# EAGLE schematic eps_version_0.4.0 (EAGLE 9.6.2)

## Sheet 1 of 9: PC104 Headers
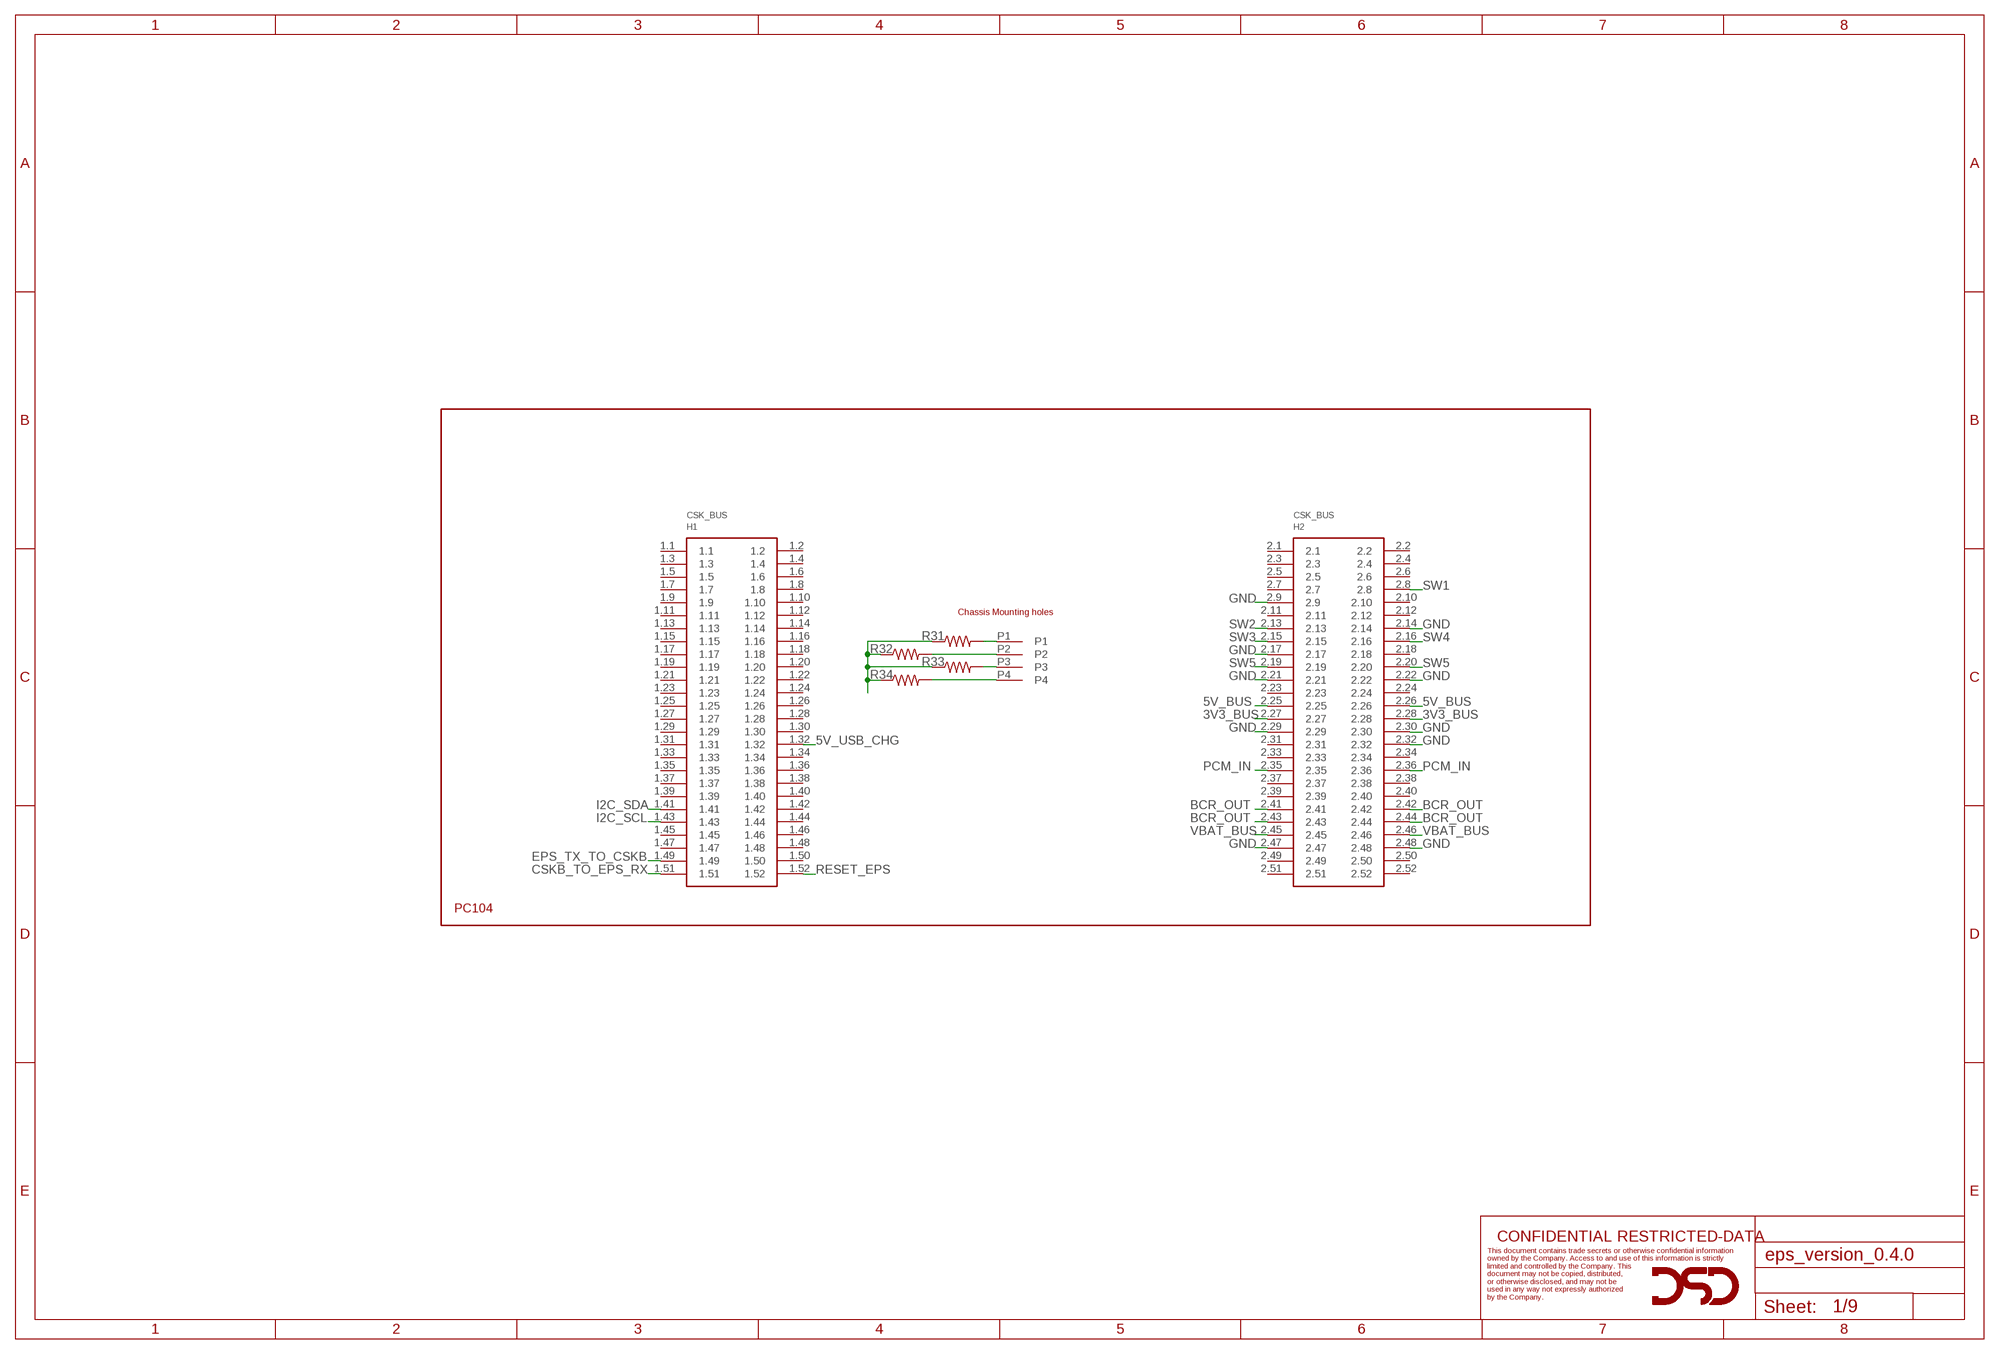
[diagram p0: schematic, sheet 1]

### Parts
H1  PC104_WCONN  [PC104_WCONN]
R31  1M  RESISTOR0805-RES  [0805]
R32  1M  RESISTOR0805-RES  [0805]
R33  1M  RESISTOR0805-RES  [0805]
R34  1M  RESISTOR0805-RES  [0805]

### Nets
3V3_BUS: H1.2.27 H1.2.28 ; also sheet 7,8
5V_BUS: H1.2.25 H1.2.26 ; also sheet 3,6,8,9
5V_USB_CHG: H1.1.32 ; also sheet 2
BCR_OUT: H1.2.41 H1.2.42 H1.2.43 H1.2.44 ; also sheet 2
CSKB_TO_EPS_RX: H1.1.51 ; also sheet 3,9
EPS_TX_TO_CSKB: H1.1.49 ; also sheet 3,9
GND: H1.2.9 H1.2.14 H1.2.17 H1.2.21 H1.2.22 H1.2.29 H1.2.30 H1.2.32 H1.2.47 H1.2.48 R31.1 R32.1 R33.1 R34.1 ; also sheet 2,3,4,5,6,7,8,9
I2C_SCL: H1.1.43 ; also sheet 3
I2C_SDA: H1.1.41 ; also sheet 3
P1_R31: H1.P1 R31.2
P2_R32: H1.P2 R32.2
P3_R33: H1.P3 R33.2
P4_R34: H1.P4 R34.2
PCM_IN: H1.2.35 H1.2.36 ; also sheet 4
RESET_EPS: H1.1.52 ; also sheet 3,9
SW1: H1.2.8 ; also sheet 5
SW2: H1.2.13 ; also sheet 8
SW3: H1.2.15 ; also sheet 8
SW4: H1.2.16 ; also sheet 8
SW5: H1.2.19 H1.2.20 ; also sheet 8
VBAT_BUS: H1.2.45 H1.2.46 ; also sheet 8
Unconnected: H1.1.1 H1.1.2 H1.1.3 H1.1.4 H1.1.5 H1.1.6 H1.1.7 H1.1.8 H1.1.9 H1.1.10 H1.1.11 H1.1.12 H1.1.13 H1.1.14 H1.1.15 H1.1.16 H1.1.17 H1.1.18 H1.1.19 H1.1.20 H1.1.21 H1.1.22 H1.1.23 H1.1.24 H1.1.25 H1.1.26 H1.1.27 H1.1.28 H1.1.29 H1.1.30 H1.1.31 H1.1.33 H1.1.34 H1.1.35 H1.1.36 H1.1.37 H1.1.38 H1.1.39 H1.1.40 H1.1.42 H1.1.44 H1.1.45 H1.1.46 H1.1.47 H1.1.48 H1.1.50 H1.2.1 H1.2.2 H1.2.3 H1.2.4 H1.2.5 H1.2.6 H1.2.7 H1.2.10 H1.2.11 H1.2.12 H1.2.18 H1.2.23 H1.2.24 H1.2.31 H1.2.33 H1.2.34 H1.2.37 H1.2.38 H1.2.39 H1.2.40 H1.2.49 H1.2.50 H1.2.51 H1.2.52

## Sheet 2 of 9: BCR
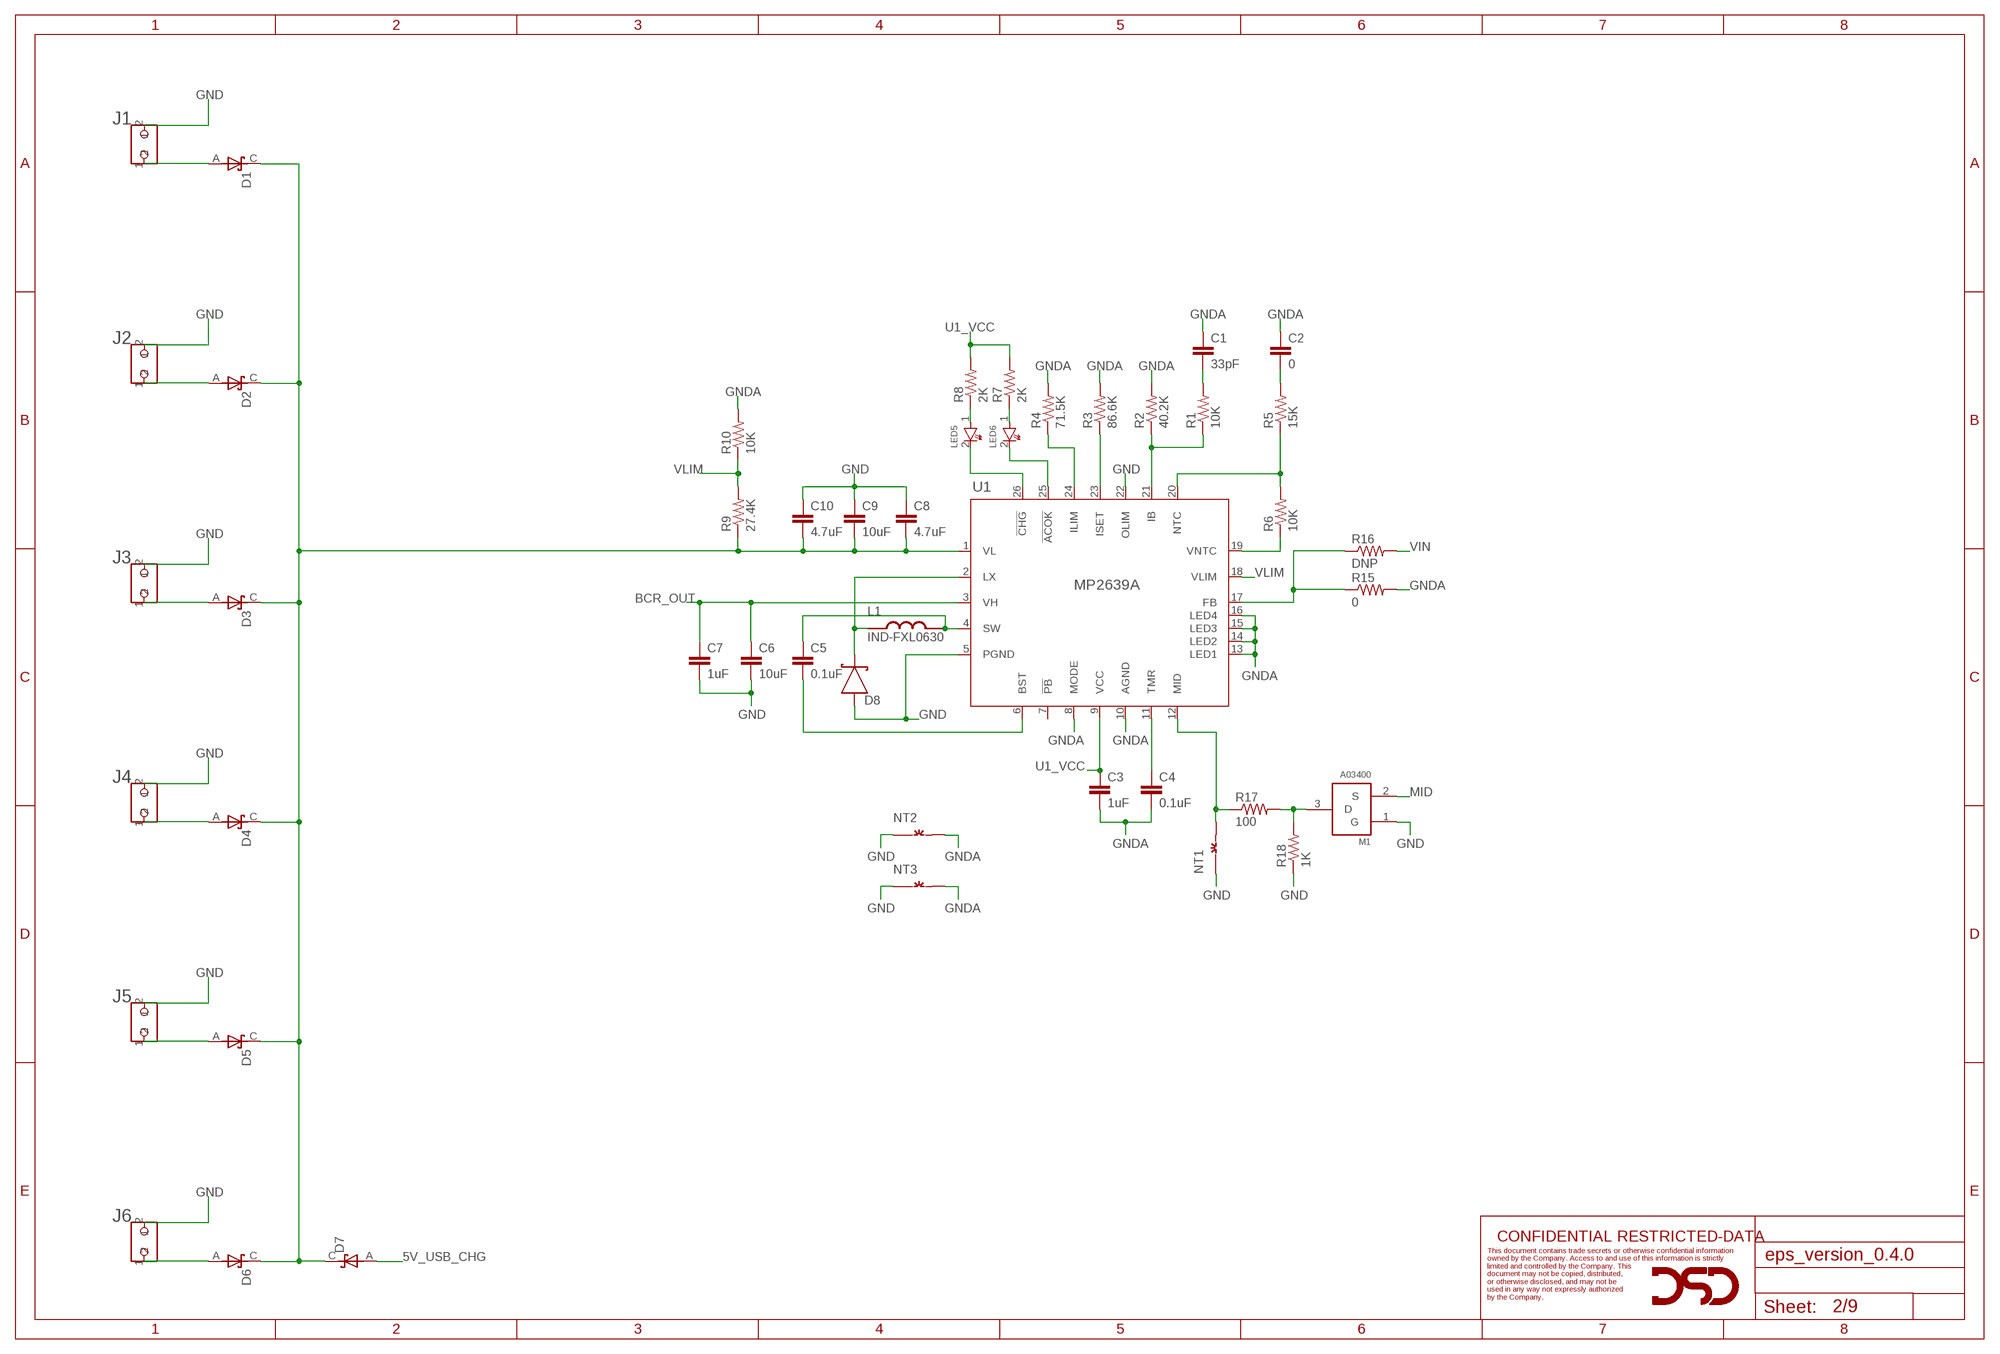
[diagram p1: schematic, sheet 2]

### Parts
C1  33pF  CAP0603-CAP  [0603-CAP]
C2  0  CAP0603-CAP  [0603-CAP]
C3  1uF  CAP0603-CAP  [0603-CAP]
C4  0.1uF  CAP0603-CAP  [0603-CAP]
C5  0.1uF  CAP0603-CAP  [0603-CAP]
C6  10uF  CAP1206  [1206]
C7  1uF  CAP0603-CAP  [0603-CAP]
C8  4.7uF  CAP0603-CAP  [0603-CAP]
C9  10uF  CAP1206  [1206]
C10  4.7uF  CAP0603-CAP  [0603-CAP]
D1  DNP  MBR2H100SFT3G  [SODFL3616X98N]
D2  DNP  MBR2H100SFT3G  [SODFL3616X98N]
D3  DNP  MBR2H100SFT3G  [SODFL3616X98N]
D4  DNP  MBR2H100SFT3G  [SODFL3616X98N]
D5  DNP  MBR2H100SFT3G  [SODFL3616X98N]
D6  DNP  MBR2H100SFT3G  [SODFL3616X98N]
D7  DNP  MBR2H100SFT3G  [SODFL3616X98N]
D8  1N5819HW  DIODE-SOD123  [SOD123]
J1  2PIN_HEADER  [2MM_2PIN_HEADER]
J2  2PIN_HEADER  [2MM_2PIN_HEADER]
J3  2PIN_HEADER  [2MM_2PIN_HEADER]
J4  2PIN_HEADER  [2MM_2PIN_HEADER]
J5  2PIN_HEADER  [2MM_2PIN_HEADER]
J6  2PIN_HEADER  [2MM_2PIN_HEADER]
L1  IND-FXL0630  [FXL0630]
LED5  LED_0805  [LED_0805]
LED6  LED_0805  [LED_0805]
M1  A03400  SOT23_NMOS  [SOT23]
NT1  GND-GNDA1,27MM  [GND-GNDA-1,27MM]
NT2  GND-GNDA1,27MM  [GND-GNDA-1,27MM]
NT3  GND-GNDA1,27MM  [GND-GNDA-1,27MM]
R1  10K  RESISTOR0603-RES  [0603-RES]
R2  40.2K  RESISTOR0603-RES  [0603-RES]
R3  86.6K  RESISTOR0603-RES  [0603-RES]
R4  71.5K  RESISTOR0603-RES  [0603-RES]
R5  15K  RESISTOR0805-RES  [0805]
R6  10K  RESISTOR0805-RES  [0805]
R7  2K  RESISTOR0603-RES  [0603-RES]
R8  2K  RESISTOR0603-RES  [0603-RES]
R9  27.4K  RESISTOR0603-RES  [0603-RES]
R10  10K  RESISTOR0603-RES  [0603-RES]
R15  0  RESISTOR0603-RES  [0603-RES]
R16  DNP  RESISTOR0603-RES  [0603-RES]
R17  100  RESISTOR0603-RES  [0603-RES]
R18  1K  RESISTOR0603-RES  [0603-RES]
U1  MP2639A  [IC26_MP2639A_MNP]

### Nets
5V_USB_CHG: D7.A ; also sheet 1
!ACOK: LED6.2 U1.25(!ACOK)
!CHG: LED5.2 U1.26(!CHG)
BCR_OUT: C6.1 C7.1 U1.3(VH) ; also sheet 1
BST: C5.2 U1.6(BST)
C1_R1: C1.2 R1.2
GND: C6.2 C7.2 C8.1 C9.1 C10.1 D8.2 J1.2 J2.2 J3.2 J4.2 J5.2 J6.2 M1.1(G) NT1.GND NT2.GND NT3.GND R18.1 U1.5(PGND) U1.22(OLIM) ; also sheet 1,3,4,5,6,7,8,9
GNDA: C1.1 C2.1 C3.2 C4.2 NT2.GNDA NT3.GNDA R2.2 R3.2 R4.2 R10.2 R15.2 U1.8(MODE) U1.10(AGND) U1.13(LED1) U1.14(LED2) U1.15(LED3) U1.16(LED4)
IB: R1.1 R2.1 U1.21(IB)
ILIM: R4.1 U1.24(ILIM)
ISET: R3.1 U1.23(ISET)
LX: D8.1 L1.1 U1.2(LX)
MID: M1.2(S) NT1.GNDA R17.1 U1.12(MID)
NTC: R5.1 R6.2 U1.20(NTC)
R5_C2: C2.2 R5.2
R7_LED6: LED6.1 R7.1
R8_LED5: LED5.1 R8.1
R17_R18: M1.3(D) R17.2 R18.2
SA1AIN: D1.A J1.1
SA1BIN: D2.A J2.1
SA2AIN: D3.A J3.1
SA2BIN: D4.A J4.1
SA3AIN: D5.A J5.1
SA3BIN: D6.A J6.1
TMR: C4.1 U1.11(TMR)
U1_FB: R15.1 R16.1 U1.17(FB)
U1_SW: C5.1 L1.2 U1.4(SW)
U1_VCC: C3.1 R7.2 R8.2 U1.9(VCC)
VIN: C8.2 C9.2 C10.2 D1.C D2.C D3.C D4.C D5.C D6.C D7.C R9.1 R16.2 U1.1(VL)
VLIM: R9.2 R10.1 U1.18(VLIM)
VNTC: R6.1 U1.19(VNTC)
Unconnected: U1.7(!PB)

## Sheet 3 of 9: MicroController
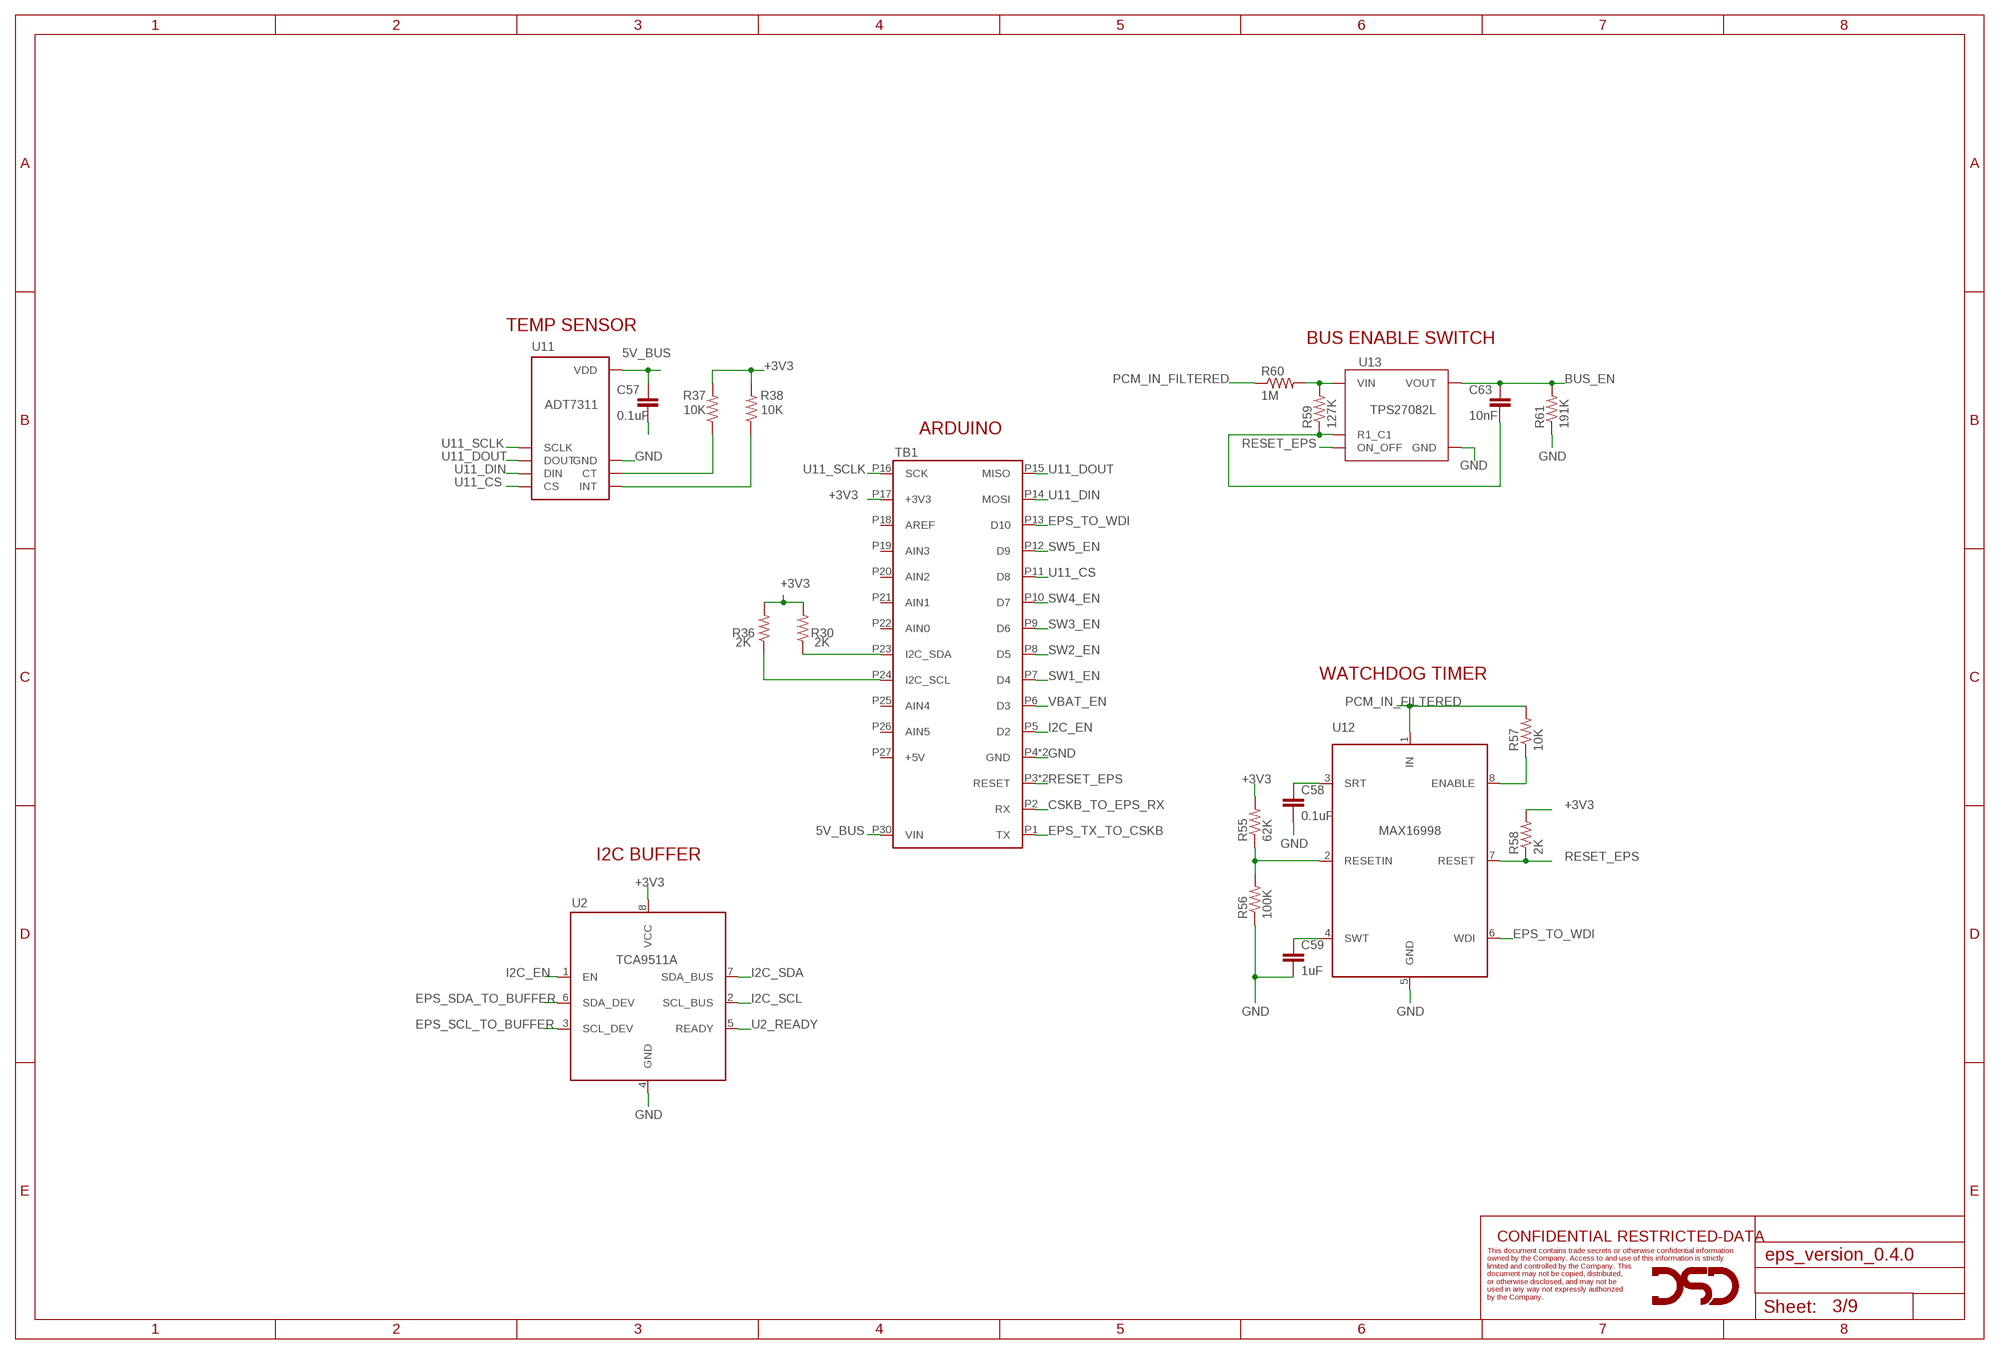
[diagram p2: schematic, sheet 3]

### Parts
C57  0.1uF  CAP0805  [0805]
C58  0.1uF  CAP0805  [0805]
C59  1uF  CAP0805  [0805]
C63  10nF  CAP0805  [0805]
R30  2K  RESISTOR0805-RES  [0805]
R36  2K  RESISTOR0805-RES  [0805]
R37  10K  RESISTOR0805-RES  [0805]
R38  10K  RESISTOR0805-RES  [0805]
R55  62K  RESISTOR0805-RES  [0805]
R56  100K  RESISTOR0805-RES  [0805]
R57  10K  RESISTOR0805-RES  [0805]
R58  2K  RESISTOR0805-RES  [0805]
R59  127K  RESISTOR0805-RES  [0805]
R60  1M  RESISTOR0805-RES  [0805]
R61  191K  RESISTOR0805-RES  [0805]
TB1  ARDUINO_NANO  [SHIELD_ARDUINO_NANO]
U2  TCA9511A  [SOP65P490X110-8N]
U11  ADT7311  [SOIC-8]
U12  MAX16998AAUA+  [21-0036K_MXM]
U13  Value  TPS27082LDDCR  [DDC0006A_N]

### Nets
5V_BUS: C57.1 TB1.P30(VIN) U11.8(VDD) ; also sheet 1,6,8,9
+3V3: R30.2 R36.2 R37.2 R38.2 R55.2 R58.2 TB1.P17(+3V3) U2.8(VCC)
BUS_EN: C63.1 R61.2 U13.2(VOUT) U13.3(VOUT) ; also sheet 6,7
CSKB_TO_EPS_RX: TB1.P2(RX) ; also sheet 1,9
EPS_SCL_TO_BUFFER: R36.1 TB1.P24(I2C_SCL) U2.3(SCL_DEV) ; also sheet 9
EPS_SDA_TO_BUFFER: R30.1 TB1.P23(I2C_SDA) U2.6(SDA_DEV) ; also sheet 9
EPS_TO_WDI: TB1.P13(D10) U12.6(WDI) ; also sheet 9
EPS_TX_TO_CSKB: TB1.P1(TX) ; also sheet 1,9
GND: C57.2 C58.2 C59.2 R56.1 R61.1 TB1.P4(GND) TB1.P29(GND) U2.4(GND) U11.7(GND) U12.5(GND) U13.1(GND) ; also sheet 1,2,4,5,6,7,8,9
I2C_EN: TB1.P5(D2) U2.1(EN) ; also sheet 9
I2C_SCL: U2.2(SCL_BUS) ; also sheet 1
I2C_SDA: U2.7(SDA_BUS) ; also sheet 1
PCM_IN_FILTERED: R57.2 R60.1 U12.1(IN) ; also sheet 4,5,6,7,8
PCM_IN_FILTERED_TO_BUS_EN: R59.2 R60.2 U13.4(VIN)
RESET_EPS: R58.1 TB1.P3(RESET) TB1.P28(RESET) U12.7(RESET) U13.5(ON_OFF) ; also sheet 1,9
SW1_EN: TB1.P7(D4) ; also sheet 5,9
SW2_EN: TB1.P8(D5) ; also sheet 8,9
SW3_EN: TB1.P9(D6) ; also sheet 8,9
SW4_EN: TB1.P10(D7) ; also sheet 8,9
SW5_EN: TB1.P12(D9) ; also sheet 8,9
U2_READY: U2.5(READY)
U11_CS: TB1.P11(D8) U11.4(CS) ; also sheet 9
U11_CT: R37.1 U11.6(CT)
U11_DIN: TB1.P14(MOSI) U11.3(DIN) ; also sheet 9
U11_DOUT: TB1.P15(MISO) U11.2(DOUT) ; also sheet 9
U11_INT: R38.1 U11.5(INT)
U11_SCLK: TB1.P16(SCK) U11.1(SCLK) ; also sheet 9
U12_EN_ALT: R57.1 U12.8(ENABLE)
U12_RESETIN: R55.1 R56.2 U12.2(RESETIN)
U12_SRT: C58.1 U12.3(SRT)
U12_SWT: C59.1 U12.4(SWT)
U13_R60_C63: C63.2 R59.1 U13.6(R1_C1)
VBAT_EN: TB1.P6(D3) ; also sheet 8,9
Unconnected: TB1.P18(AREF) TB1.P19(AIN3) TB1.P20(AIN2) TB1.P21(AIN1) TB1.P22(AIN0) TB1.P25(AIN4) TB1.P26(AIN5) TB1.P27(+5V)

### Notes on the sheet
- TEMP SENSOR
- BUS ENABLE SWITCH
- ARDUINO
- WATCHDOG TIMER
- I2C BUFFER

## Sheet 4 of 9: PCM_IN Filter
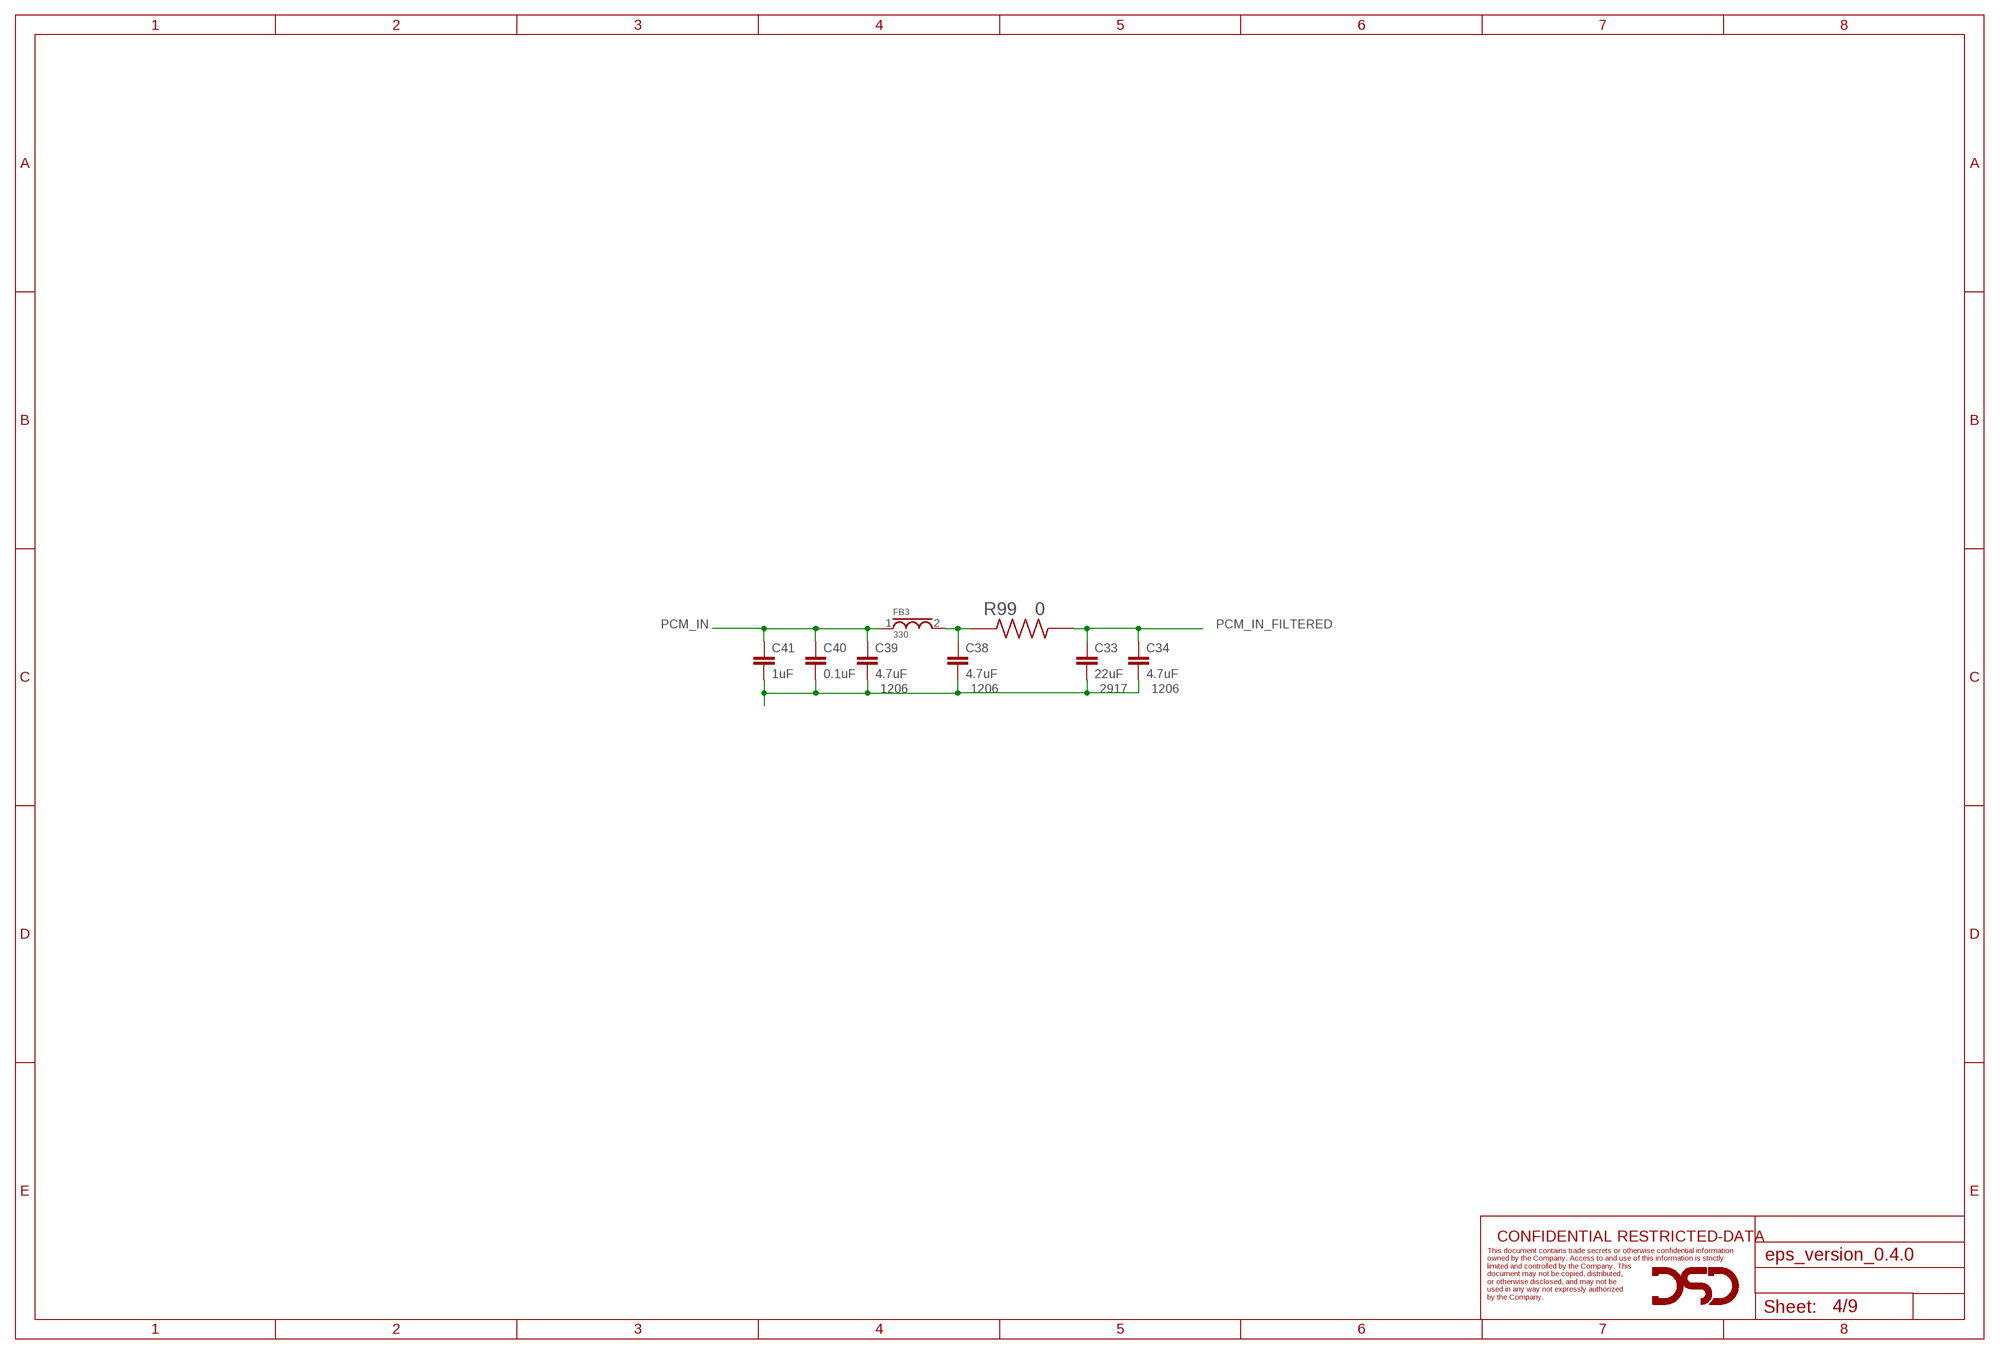
[diagram p3: schematic, sheet 4]

### Parts
C33  22uF  CAP_29172917  [CAPMP7343X430N]
C34  4.7uF  CAP1206  [1206]
C38  4.7uF  CAP1206  [1206]
C39  4.7uF  CAP1206  [1206]
C40  0.1uF  CAP0805  [0805]
C41  1uF  CAP0805  [0805]
FB3  330  FB_0805  [0805]
R99  0  CRCW20100000Z0EF  [RESC5025X70N]

### Nets
FB3_L3: C38.1 FB3.2 R99.1
GND: C33.2 C34.2 C38.2 C39.2 C40.2 C41.2 ; also sheet 1,2,3,5,6,7,8,9
PCM_IN: C39.1 C40.1 C41.1 FB3.1 ; also sheet 1
PCM_IN_FILTERED: C33.1 C34.1 R99.2 ; also sheet 3,5,6,7,8

### Notes on the sheet
- 1206 | 1206 | 2917 | 1206

## Sheet 5 of 9: 5V BURN
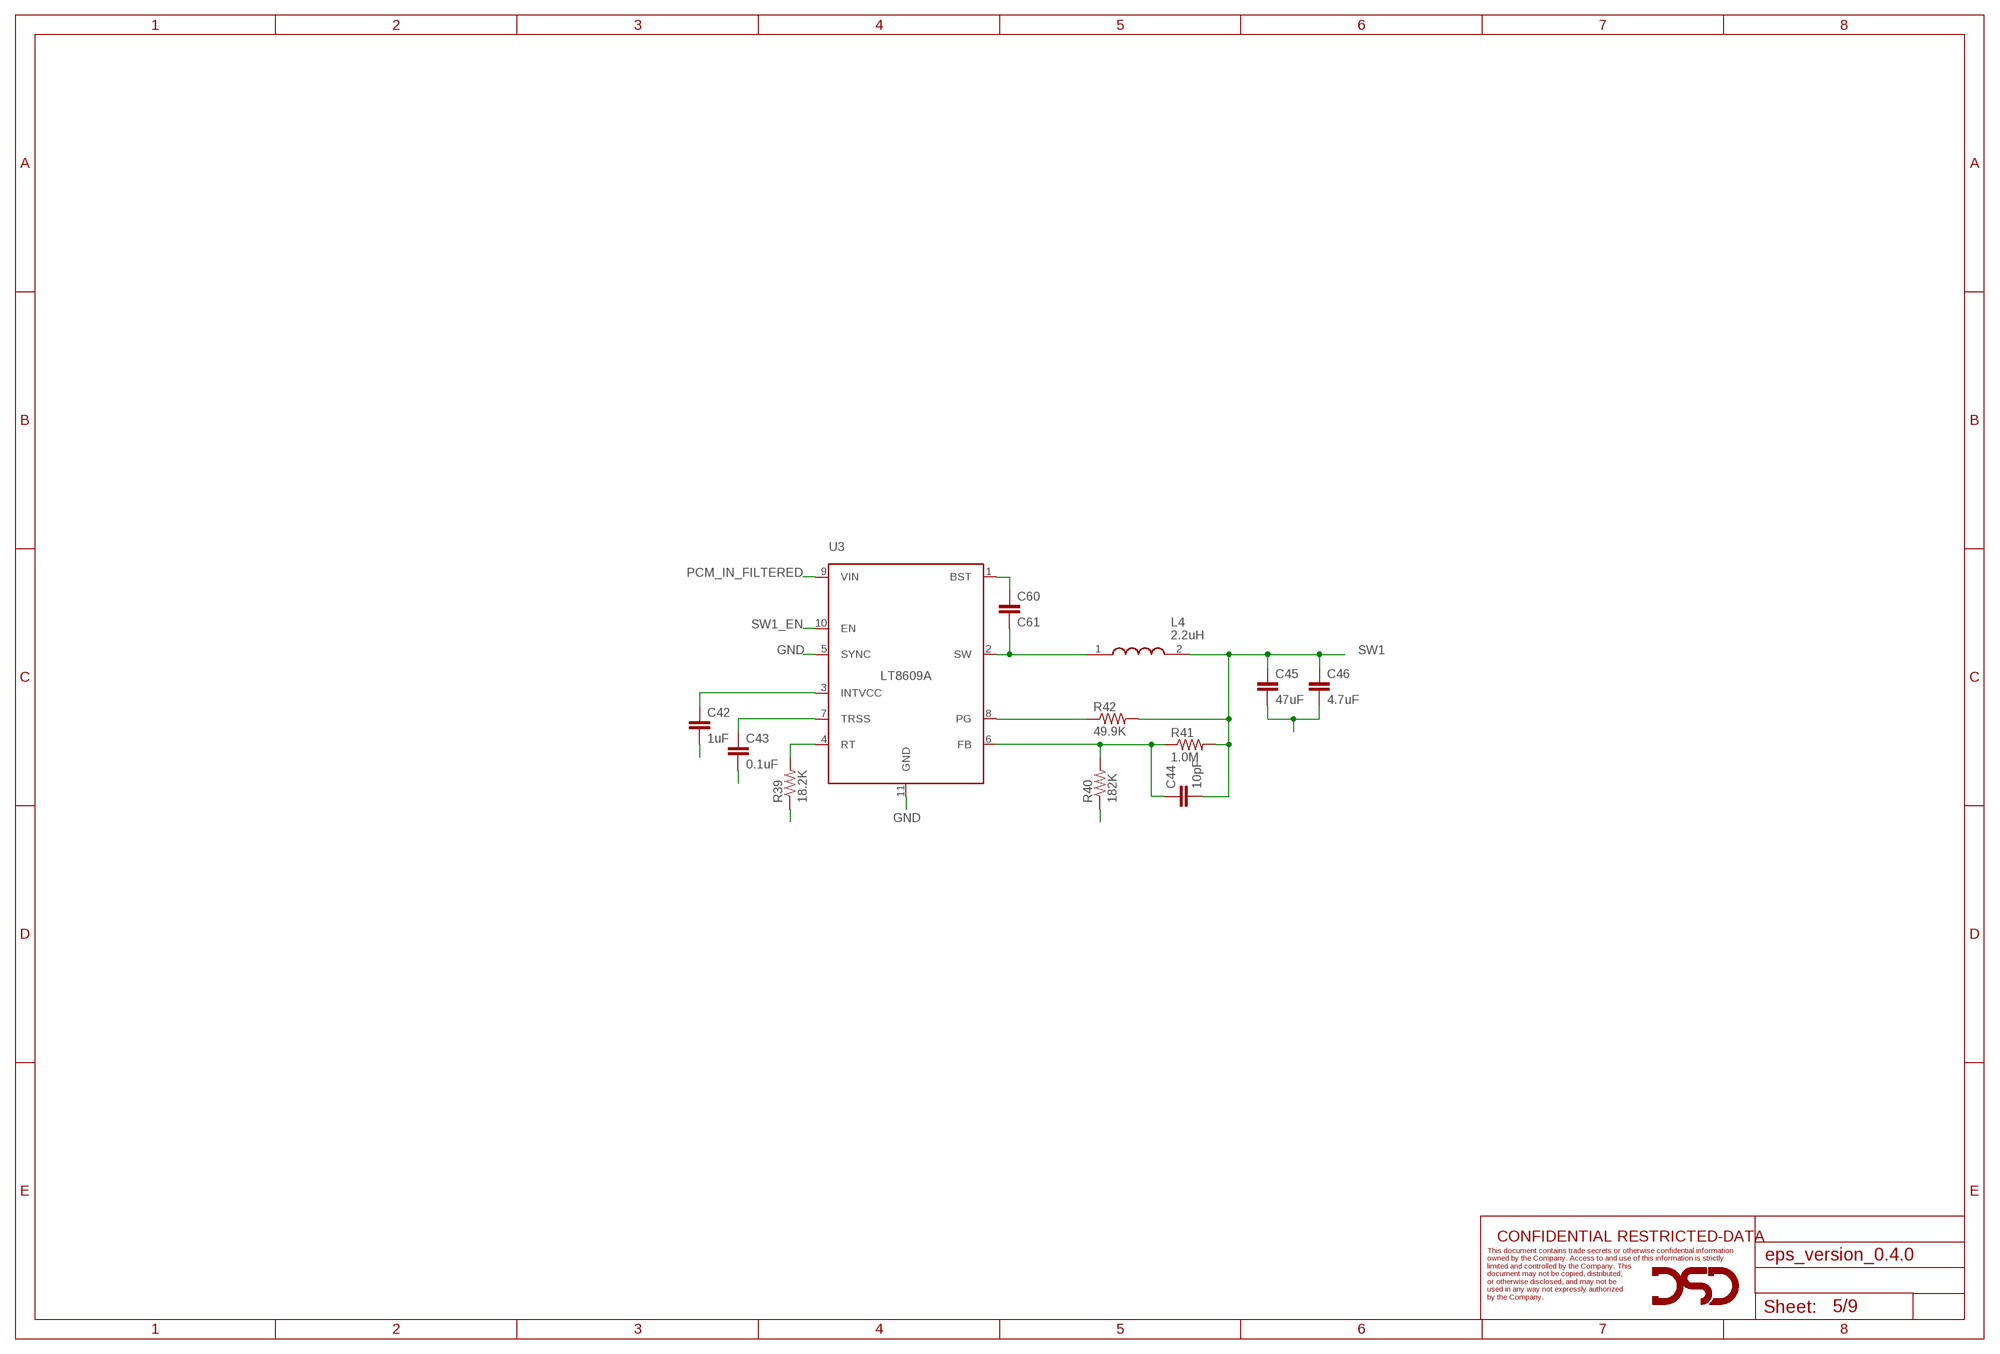
[diagram p4: schematic, sheet 5]

### Parts
C42  1uF  CAP0805  [0805]
C43  0.1uF  CAP0805  [0805]
C44  10pF  CAP0805  [0805]
C45  47uF  CAP1210  [1210]
C46  4.7uF  CAP0805  [0805]
C60  C61  CAP0805  [0805]
L4  2.2uH  XFL4020-222MEC  [XFL4030472MEB]
R39  18.2K  RESISTOR0805-RES  [0805]
R40  182K  RESISTOR0805-RES  [0805]
R41  1.0M  RESISTOR0805-RES  [0805]
R42  49.9K  RESISTOR0805-RES  [0805]
U3  LT8609A  [MSOP-10_MSE]

### Nets
FB_SW1: C44.1 R40.2 R41.1 U3.6(FB)
GND: C42.2 C43.2 C45.2 C46.2 R39.1 R40.1 U3.5(SYNC) U3.11(GND) ; also sheet 1,2,3,4,6,7,8,9
PCM_IN_FILTERED: U3.9(VIN) ; also sheet 3,4,6,7,8
PG_SW1: R42.1 U3.8(PG)
RT_SW1: R39.2 U3.4(RT)
SW1: C44.2 C45.1 C46.1 L4.2 R41.2 R42.2 ; also sheet 1
SW1_EN: U3.10(EN) ; also sheet 3,9
SW_SW1: C60.2 L4.1 U3.2(SW)
TRSS_SW1: C43.1 U3.7(TRSS)
U3_BST: C60.1 U3.1(BST)
VCC_SW1: C42.1 U3.3(INTVCC)

## Sheet 6 of 9: 5V_BUS
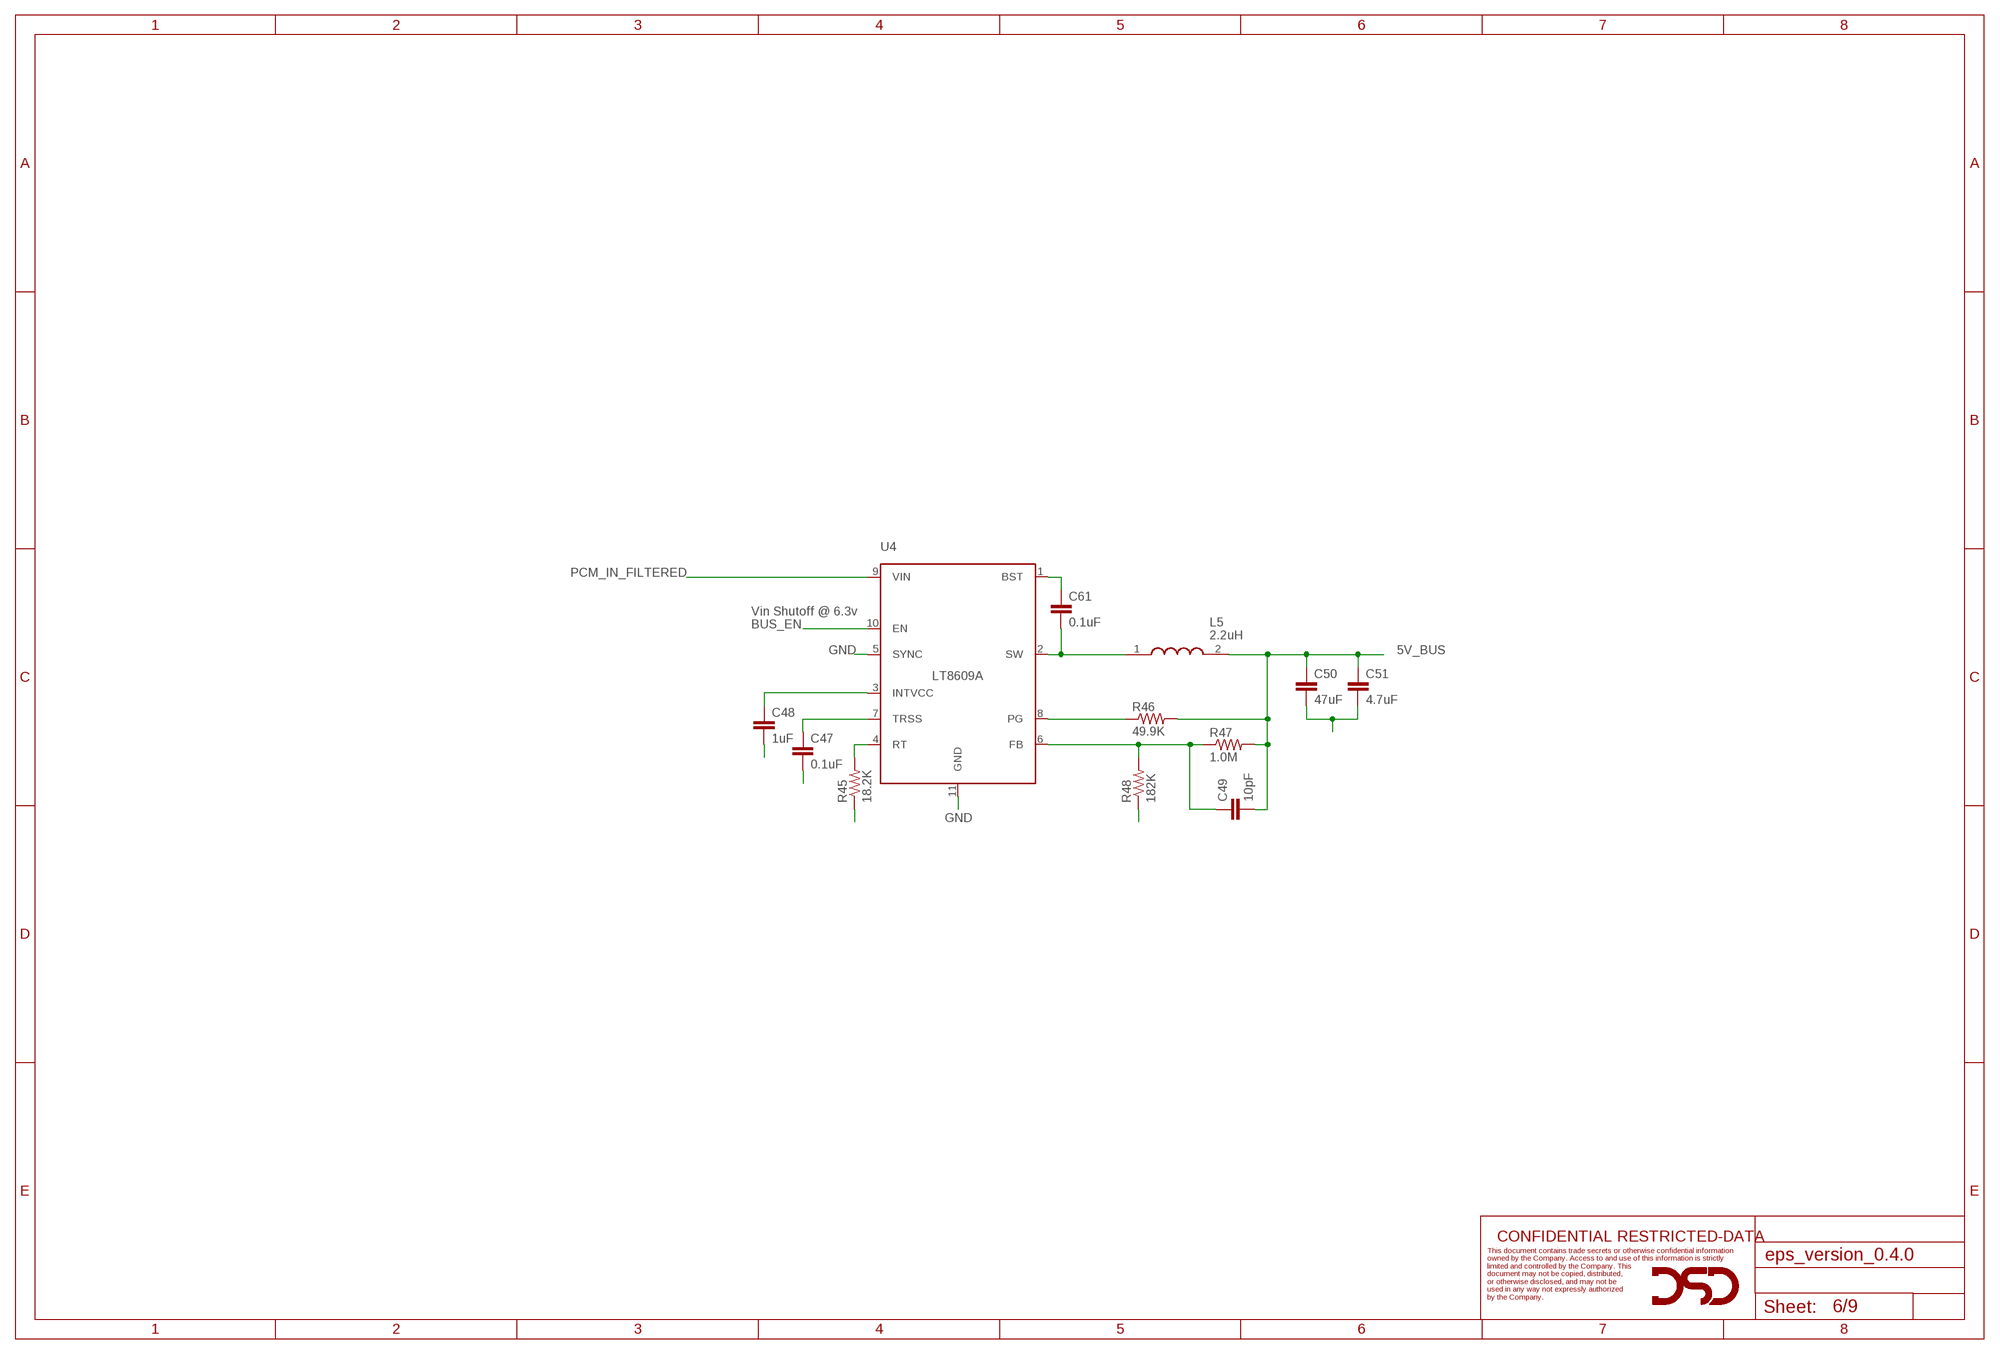
[diagram p5: schematic, sheet 6]

### Parts
C47  0.1uF  CAP0805  [0805]
C48  1uF  CAP0805  [0805]
C49  10pF  CAP0805  [0805]
C50  47uF  CAP1210  [1210]
C51  4.7uF  CAP0805  [0805]
C61  0.1uF  CAP0805  [0805]
L5  2.2uH  XFL4020-222MEC  [XFL4030472MEB]
R45  18.2K  RESISTOR0805-RES  [0805]
R46  49.9K  RESISTOR0805-RES  [0805]
R47  1.0M  RESISTOR0805-RES  [0805]
R48  182K  RESISTOR0805-RES  [0805]
U4  LT8609A  [MSOP-10_MSE]

### Nets
5V_BUS: C49.2 C50.1 C51.1 L5.2 R46.2 R47.2 ; also sheet 1,3,8,9
BST_5V_BUS: C61.1 U4.1(BST)
BUS_EN: U4.10(EN) ; also sheet 3,7
FB_5V_BUS: C49.1 R47.1 R48.2 U4.6(FB)
GND: C47.2 C48.2 C50.2 C51.2 R45.1 R48.1 U4.5(SYNC) U4.11(GND) ; also sheet 1,2,3,4,5,7,8,9
PCM_IN_FILTERED: U4.9(VIN) ; also sheet 3,4,5,7,8
PG_5V_BUS: R46.1 U4.8(PG)
RT_5V_BUS: R45.2 U4.4(RT)
SW_5V_BUS: C61.2 L5.1 U4.2(SW)
TRSS_5V_BUS: C47.1 U4.7(TRSS)
VCC_5V_BUS: C48.1 U4.3(INTVCC)

### Notes on the sheet
- Vin Shutoff @ 6.3v

## Sheet 7 of 9: 3V3_BUS
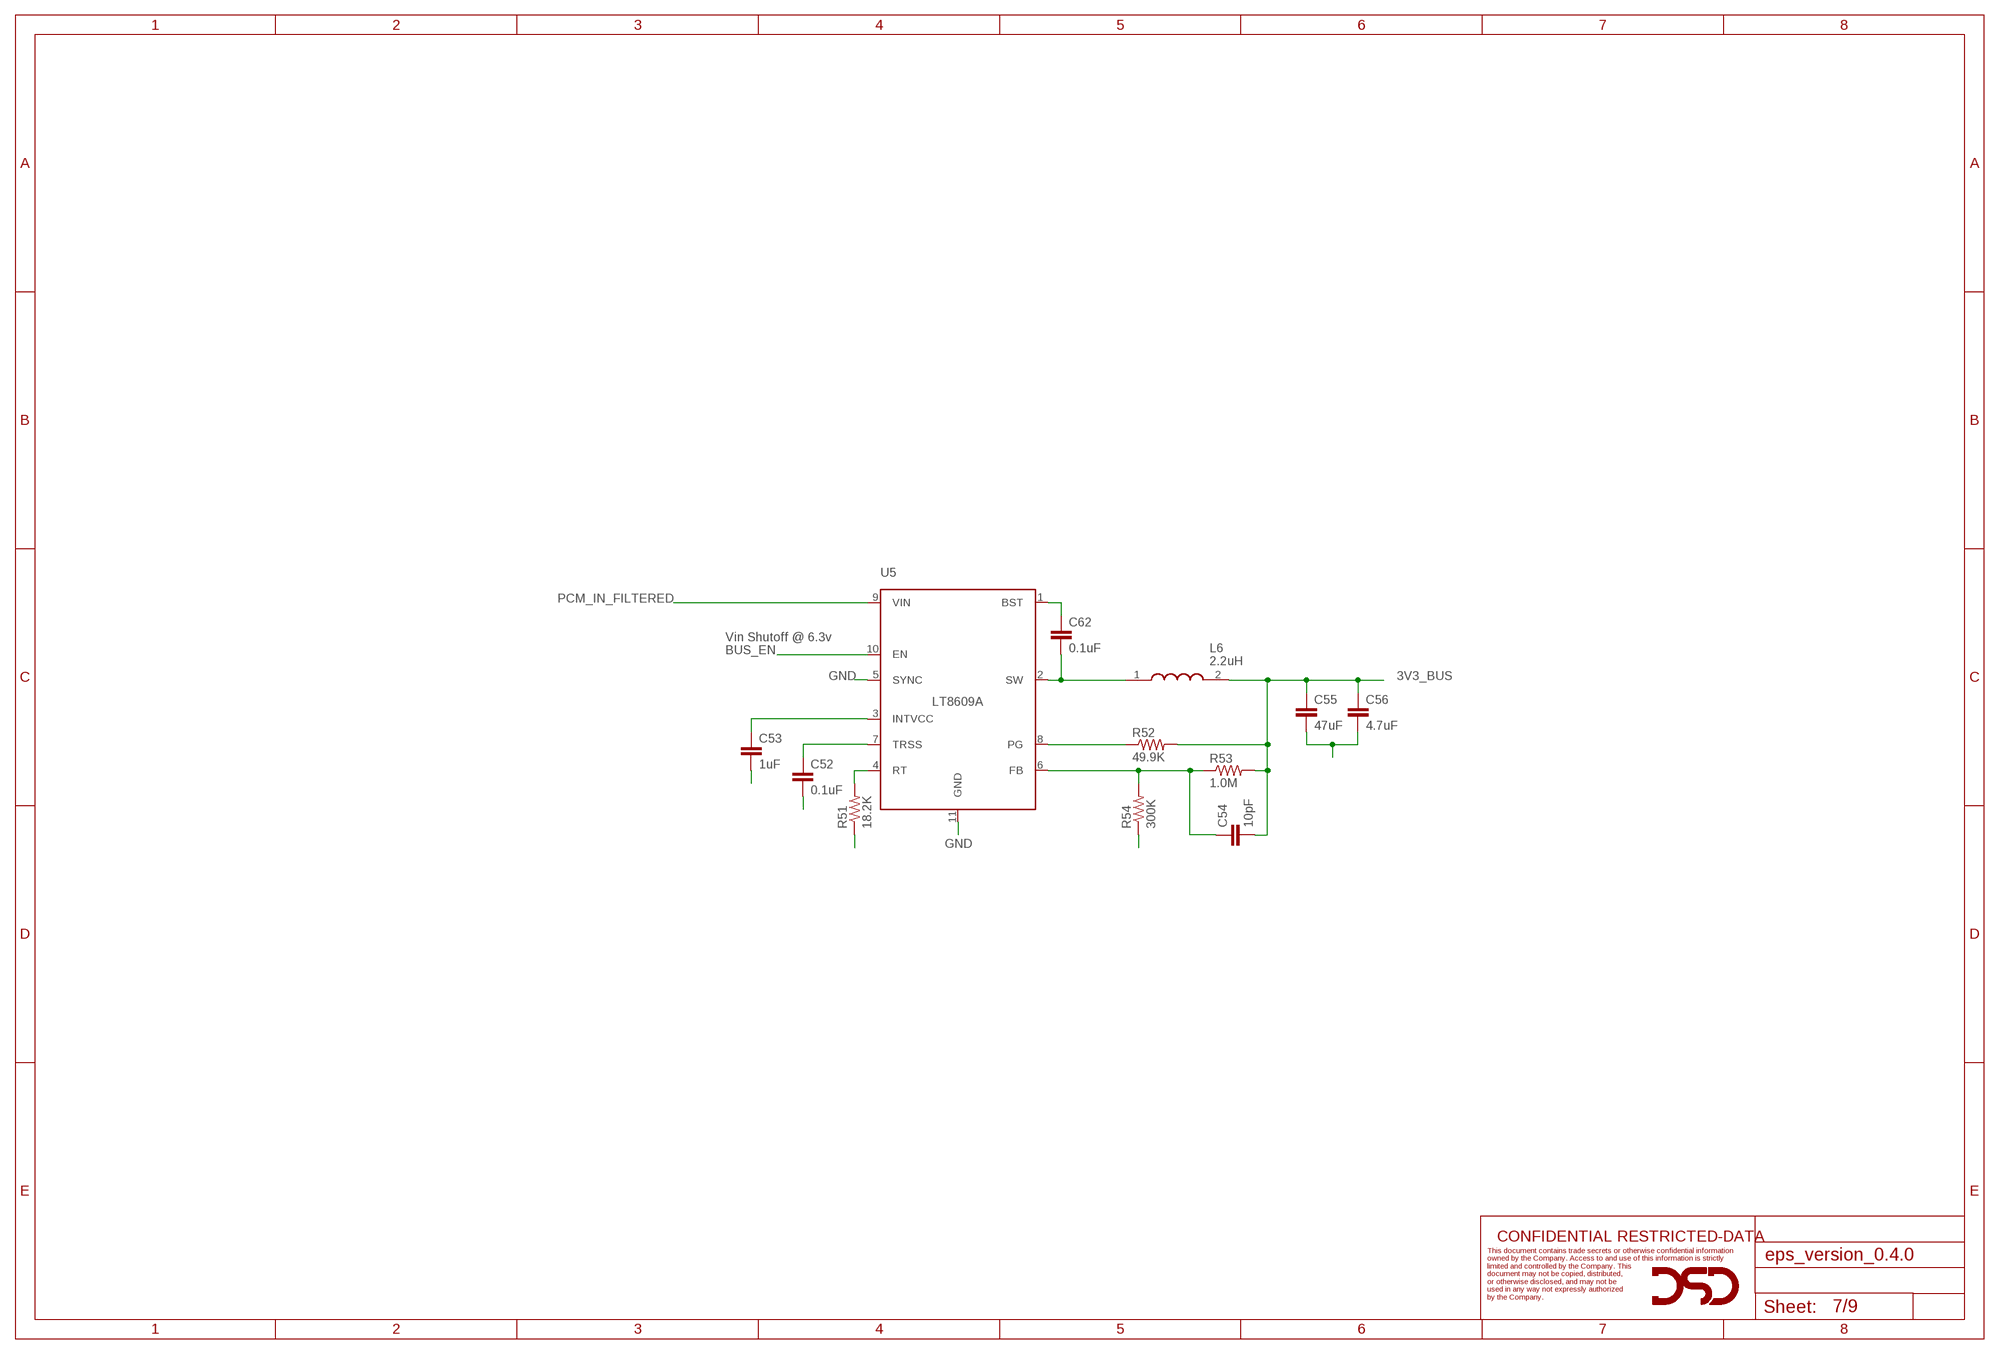
[diagram p6: schematic, sheet 7]

### Parts
C52  0.1uF  CAP0805  [0805]
C53  1uF  CAP0805  [0805]
C54  10pF  CAP0805  [0805]
C55  47uF  CAP1210  [1210]
C56  4.7uF  CAP0805  [0805]
C62  0.1uF  CAP0805  [0805]
L6  2.2uH  XFL4020-222MEC  [XFL4030472MEB]
R51  18.2K  RESISTOR0805-RES  [0805]
R52  49.9K  RESISTOR0805-RES  [0805]
R53  1.0M  RESISTOR0805-RES  [0805]
R54  300K  RESISTOR0805-RES  [0805]
U5  LT8609A  [MSOP-10_MSE]

### Nets
3V3_BUS: C54.2 C55.1 C56.1 L6.2 R52.2 R53.2 ; also sheet 1,8
BST_3V3_BUS: C62.1 U5.1(BST)
BUS_EN: U5.10(EN) ; also sheet 3,6
FB_3V3_BUS: C54.1 R53.1 R54.2 U5.6(FB)
GND: C52.2 C53.2 C55.2 C56.2 R51.1 R54.1 U5.5(SYNC) U5.11(GND) ; also sheet 1,2,3,4,5,6,8,9
PCM_IN_FILTERED: U5.9(VIN) ; also sheet 3,4,5,6,8
PG_3V3_BUS: R52.1 U5.8(PG)
RT_3V3_BUS: R51.2 U5.4(RT)
SW_3V3_BUS: C62.2 L6.1 U5.2(SW)
TRSS_3V3_BUS: C52.1 U5.7(TRSS)
VCC_3V3_BUS: C53.1 U5.3(INTVCC)

### Notes on the sheet
- Vin Shutoff @ 6.3v

## Sheet 8 of 9: SWITCHES
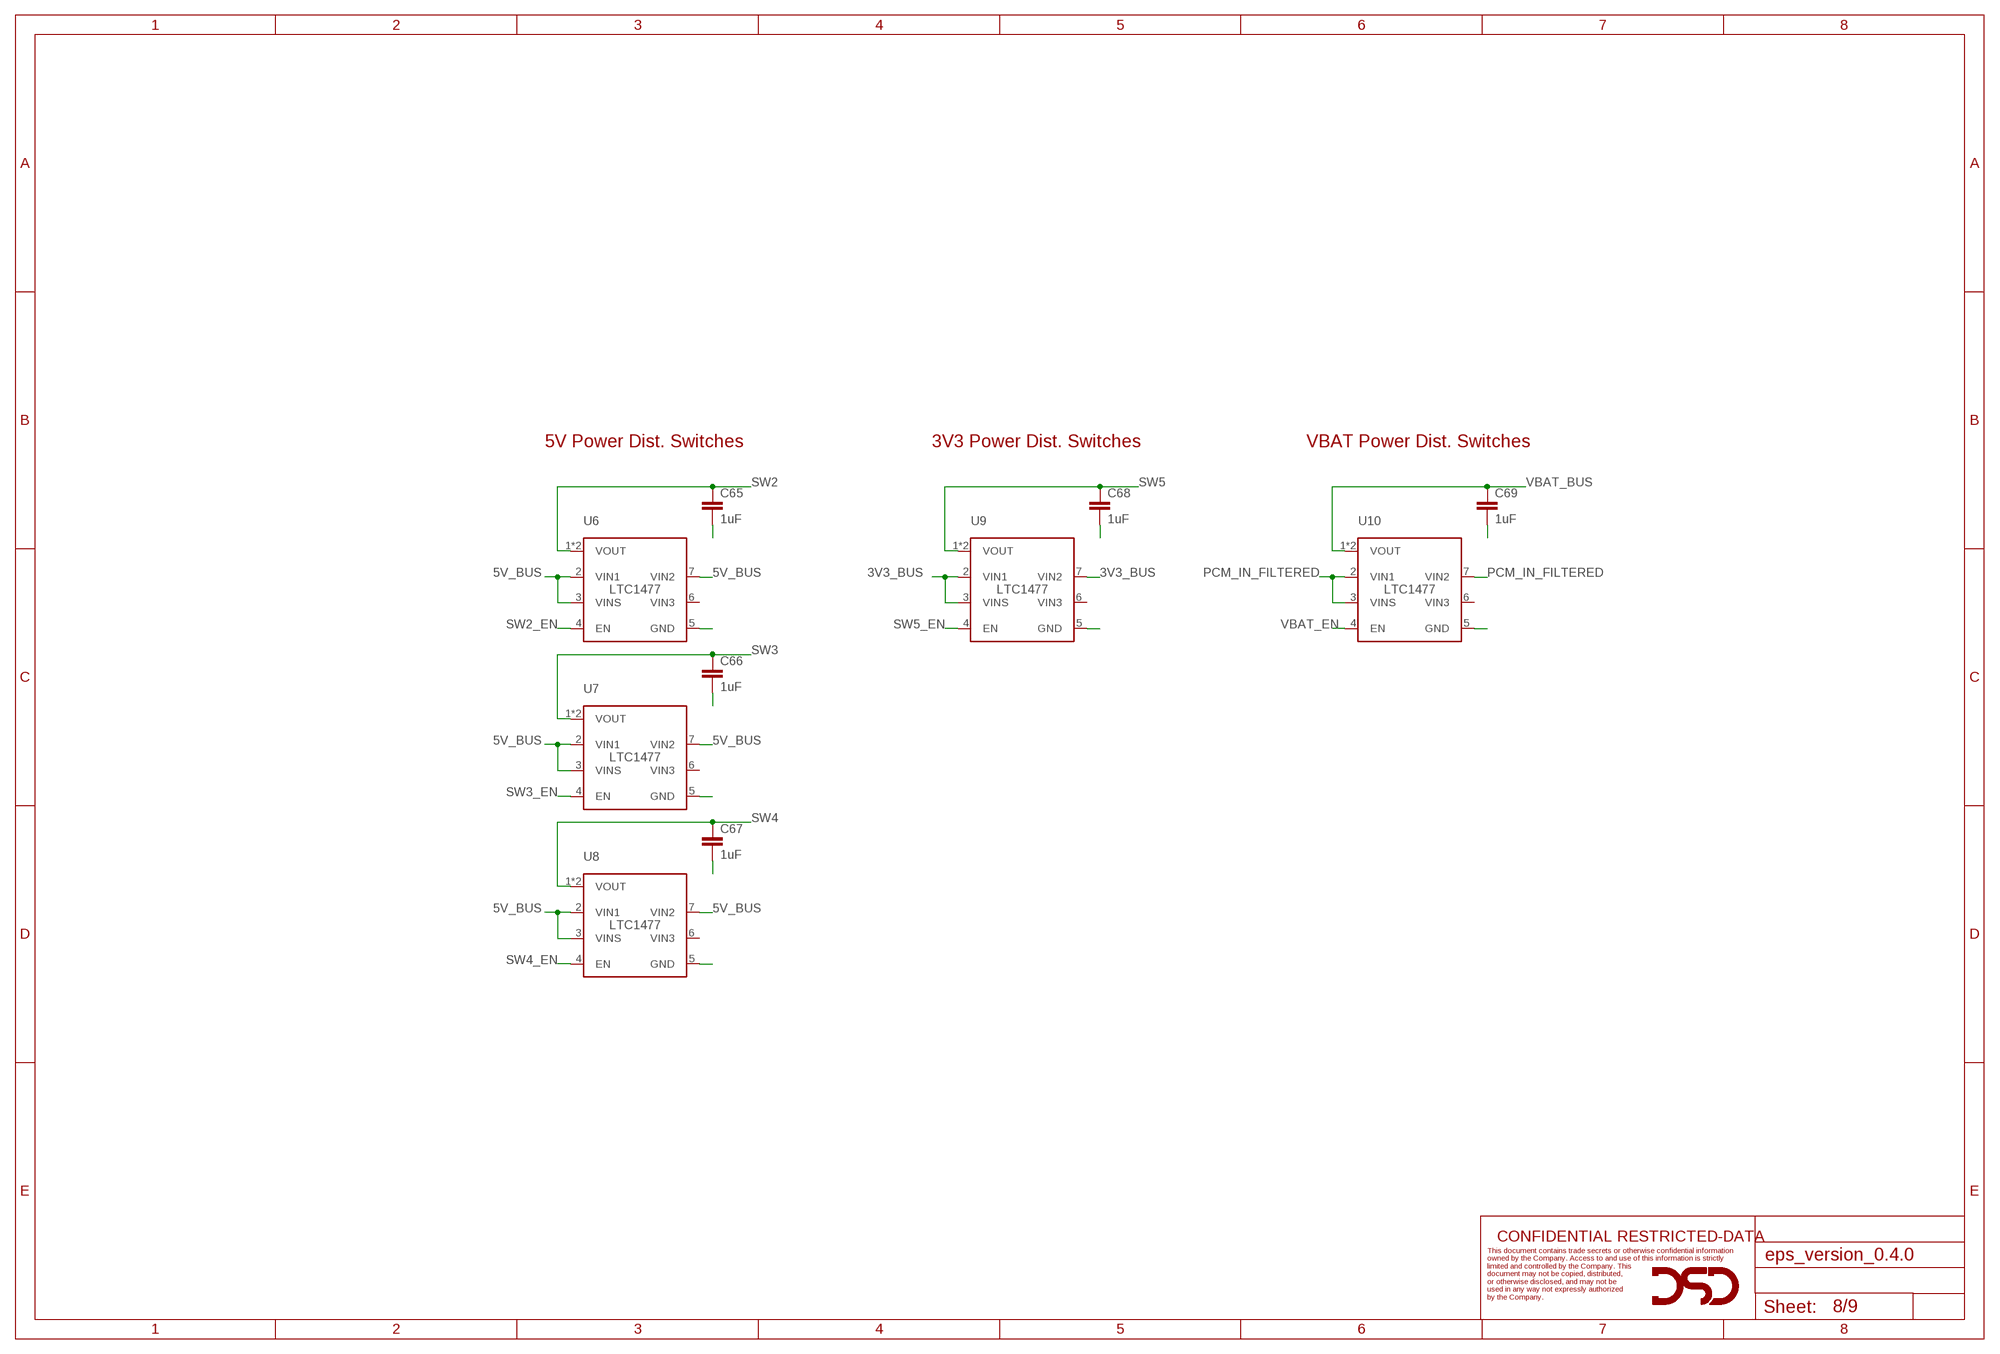
[diagram p7: schematic, sheet 8]

### Parts
C65  1uF  CAP0805  [0805]
C66  1uF  CAP0805  [0805]
C67  1uF  CAP0805  [0805]
C68  1uF  CAP0805  [0805]
C69  1uF  CAP0805  [0805]
U6  LTC1477  [SO8]
U7  LTC1477  [SO8]
U8  LTC1477  [SO8]
U9  LTC1477  [SO8]
U10  LTC1477  [SO8]

### Nets
3V3_BUS: U9.2(VIN1) U9.3(VINS) U9.7(VIN2) ; also sheet 1,7
5V_BUS: U6.2(VIN1) U6.3(VINS) U6.7(VIN2) U7.2(VIN1) U7.3(VINS) U7.7(VIN2) U8.2(VIN1) U8.3(VINS) U8.7(VIN2) ; also sheet 1,3,6,9
GND: C65.2 C66.2 C67.2 C68.2 C69.2 U6.5(GND) U7.5(GND) U8.5(GND) U9.5(GND) U10.5(GND) ; also sheet 1,2,3,4,5,6,7,9
PCM_IN_FILTERED: U10.2(VIN1) U10.3(VINS) U10.7(VIN2) ; also sheet 3,4,5,6,7
SW2: C65.1 U6.1(VOUT) U6.8(VOUT) ; also sheet 1
SW2_EN: U6.4(EN) ; also sheet 3,9
SW3: C66.1 U7.1(VOUT) U7.8(VOUT) ; also sheet 1
SW3_EN: U7.4(EN) ; also sheet 3,9
SW4: C67.1 U8.1(VOUT) U8.8(VOUT) ; also sheet 1
SW4_EN: U8.4(EN) ; also sheet 3,9
SW5: C68.1 U9.1(VOUT) U9.8(VOUT) ; also sheet 1
SW5_EN: U9.4(EN) ; also sheet 3,9
VBAT_BUS: C69.1 U10.1(VOUT) U10.8(VOUT) ; also sheet 1
VBAT_EN: U10.4(EN) ; also sheet 3,9
Unconnected: U6.6(VIN3) U7.6(VIN3) U8.6(VIN3) U9.6(VIN3) U10.6(VIN3)

### Notes on the sheet
- 5V Power Dist. Switches | 3V3 Power Dist. Switches | VBAT Power Dist. Switches

## Sheet 9 of 9
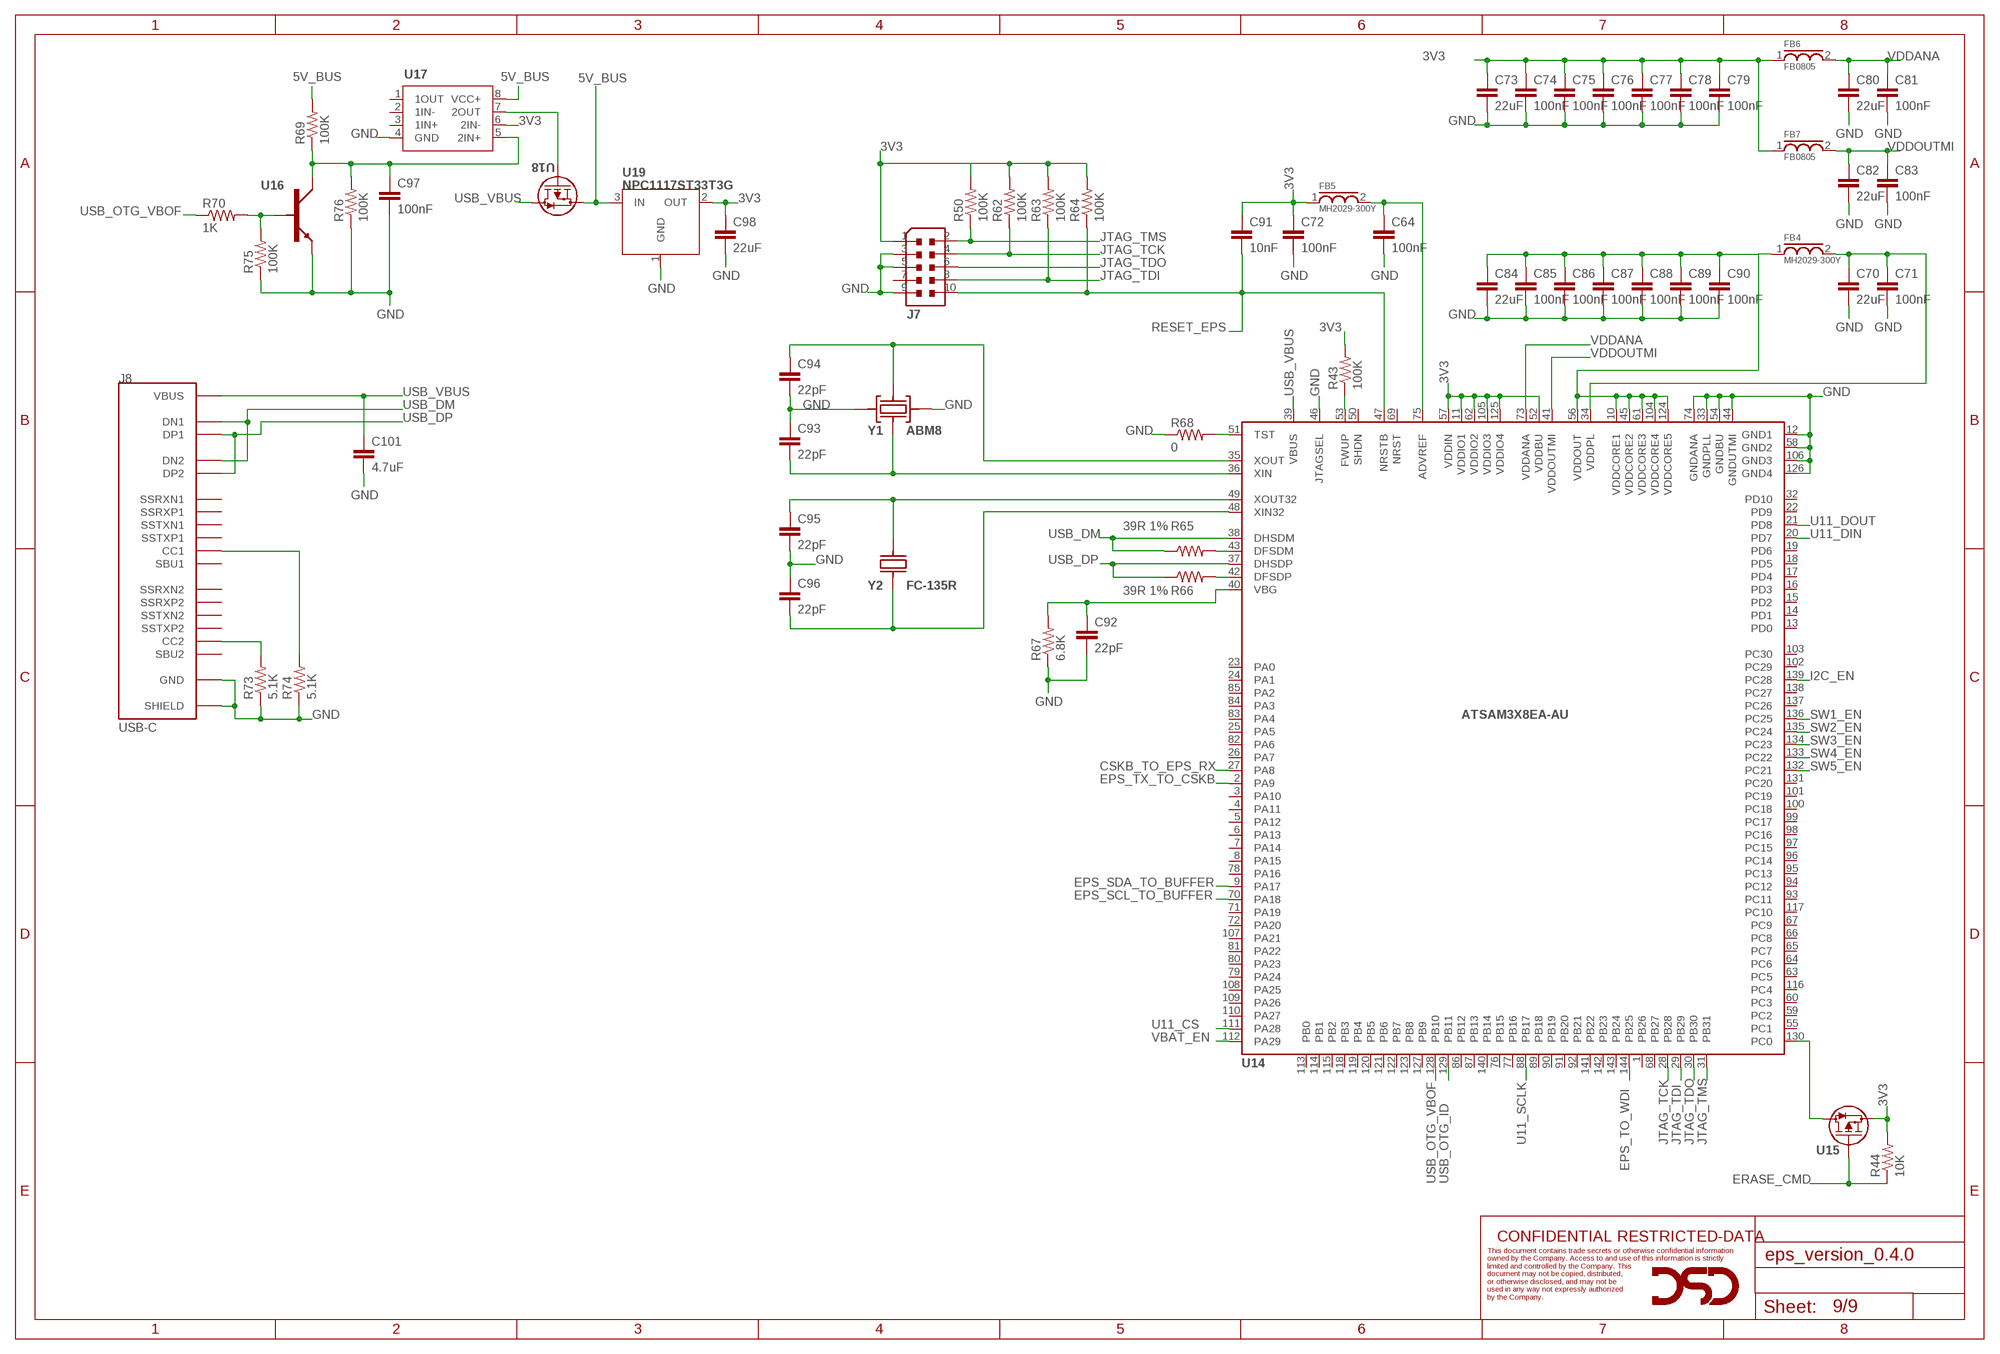
[diagram p8: schematic, sheet 9]

### Parts
C64  100nF  CAP0603-CAP  [0603-CAP]
C70  22uF  CAP0603-CAP  [0603-CAP]
C71  100nF  CAP0603-CAP  [0603-CAP]
C72  100nF  CAP0603-CAP  [0603-CAP]
C73  22uF  CAP0603-CAP  [0603-CAP]
C74  100nF  CAP0603-CAP  [0603-CAP]
C75  100nF  CAP0603-CAP  [0603-CAP]
C76  100nF  CAP0603-CAP  [0603-CAP]
C77  100nF  CAP0603-CAP  [0603-CAP]
C78  100nF  CAP0603-CAP  [0603-CAP]
C79  100nF  CAP0603-CAP  [0603-CAP]
C80  22uF  CAP0603-CAP  [0603-CAP]
C81  100nF  CAP0603-CAP  [0603-CAP]
C82  22uF  CAP0603-CAP  [0603-CAP]
C83  100nF  CAP0603-CAP  [0603-CAP]
C84  22uF  CAP0603-CAP  [0603-CAP]
C85  100nF  CAP0603-CAP  [0603-CAP]
C86  100nF  CAP0603-CAP  [0603-CAP]
C87  100nF  CAP0603-CAP  [0603-CAP]
C88  100nF  CAP0603-CAP  [0603-CAP]
C89  100nF  CAP0603-CAP  [0603-CAP]
C90  100nF  CAP0603-CAP  [0603-CAP]
C91  10nF  CAP0603-CAP  [0603-CAP]
C92  22pF  CAP0603-CAP  [0603-CAP]
C93  22pF  CAP0603-CAP  [0603-CAP]
C94  22pF  CAP0603-CAP  [0603-CAP]
C95  22pF  CAP0603-CAP  [0603-CAP]
C96  22pF  CAP0603-CAP  [0603-CAP]
C97  100nF  CAP0603-CAP  [0603-CAP]
C98  22uF  CAP0603-CAP  [0603-CAP]
C101  4.7uF  CAP0603-CAP  [0603-CAP]
FB4  MH2029-300Y  FB0805  [0805]
FB5  MH2029-300Y  FB0805  [0805]
FB6  FB0805  [0805]
FB7  FB0805  [0805]
J7  CONN_2X5_127  [2X5_127]
J8  USB-C  [CUI_UJ31-CH-G1-SMT-TR]
R43  100K  RESISTOR0603-RES  [0603-RES]
R44  10K  RESISTOR0603-RES  [0603-RES]
R50  100K  RESISTOR0603-RES  [0603-RES]
R62  100K  RESISTOR0603-RES  [0603-RES]
R63  100K  RESISTOR0603-RES  [0603-RES]
R64  100K  RESISTOR0603-RES  [0603-RES]
R65  39R 1%  RESISTOR0603-RES  [0603-RES]
R66  39R 1%  RESISTOR0603-RES  [0603-RES]
R67  6.8K  RESISTOR0603-RES  [0603-RES]
R68  0  RESISTOR0402-RES  [0402-RES]
R69  100K  RESISTOR0603-RES  [0603-RES]
R70  1K  RESISTOR0603-RES  [0603-RES]
R73  5.1K  RESISTOR0603-RES  [0603-RES]
R74  5.1K  RESISTOR0603-RES  [0603-RES]
R75  100K  RESISTOR0603-RES  [0603-RES]
R76  100K  RESISTOR0603-RES  [0603-RES]
U14  ATSAM3X8EA-AU  [LQFP144]
U15  PMV48XP  PMV48XP,215  [TO-236_SOT23_NEX]
U16  BC847B-7-F  [TO-236_SOT23_NEX]
U17  LMV358IDGKR  [DGK8]
U18  PMV48XP,215  [TO-236_SOT23_NEX]
U19  NCP1117ST33T3G  [SOT223-3_ONS]
Y1  ABM8  [ABM8]
Y2  FC-135R  [FC-135]

### Nets
3V3: C72.1 C73.1 C74.1 C75.1 C76.1 C77.1 C78.1 C79.1 C91.1 C98.1 FB5.1 FB6.1 FB7.1 J7.1 R43.2 R44.2 R50.2 R62.2 R63.2 R64.2 U14.11(VDDIO1) U14.52(VDDBU) U14.57(VDDIN) U14.62(VDDIO2) U14.105(VDDIO3) U14.125(VDDIO4) U15.2(S) U17.6(2IN-) U19.2(OUT)
5V_BUS: R69.2 U17.8(VCC+) U18.2(S) U19.3(IN) ; also sheet 1,3,6,8
5V_BUS_U17_+: C97.1 R69.1 R76.2 U16.3(C) U17.5(2IN+)
AVREF: C64.1 FB5.2 U14.75(ADVREF)
CC1: J8.A5(CC1) R74.2
CC2: J8.B5(CC2) R73.2
CSKB_TO_EPS_RX: U14.27(PA8) ; also sheet 1,3
EPS_SCL_TO_BUFFER: U14.70(PA18) ; also sheet 3
EPS_SDA_TO_BUFFER: U14.9(PA17) ; also sheet 3
EPS_TO_WDI: U14.144(PB25) ; also sheet 3
EPS_TX_TO_CSKB: U14.2(PA9) ; also sheet 1,3
ERASE_CMD: R44.1 U15.1(G)
ERASE_S: U14.130(PC0) U15.3(D)
FWUP_R43: R43.1 U14.53(FWUP)
GND: C64.2 C70.2 C71.2 C72.2 C73.2 C74.2 C75.2 C76.2 C77.2 C78.2 C79.2 C80.2 C81.2 C82.2 C83.2 C84.2 C85.2 C86.2 C87.2 C88.2 C89.2 C90.2 C92.2 C93.1 C94.2 C95.2 C96.1 C97.2 C98.2 C101.2 J7.3 J7.5 J7.9 J8.A1(GND) J8.A12(GND) J8.B1(GND) J8.B12(GND) J8.SH1(SHIELD) J8.SH2(SHIELD) J8.SH3(SHIELD) J8.SH4(SHIELD) J8.SH5(SHIELD) J8.SH6(SHIELD) R67.1 R68.1 R73.1 R74.1 R75.1 R76.1 U14.12(GND1) U14.33(GNDPLL) U14.44(GNDUTMI) U14.46(JTAGSEL) U14.54(GNDBU) U14.58(GND2) U14.74(GNDANA) U14.106(GND3) U14.126(GND4) U16.2(E) U17.4(GND) U19.1(GND) Y1.2 Y1.4 ; also sheet 1,2,3,4,5,6,7,8
I2C_EN: U14.139(PC28) ; also sheet 3
JTAG_TCK: J7.4 R62.1 U14.28(PB28)
JTAG_TDI: J7.8 R63.1 U14.29(PB29)
JTAG_TDO: J7.6 U14.30(PB30)
JTAG_TMS: J7.2 R50.1 U14.31(PB31)
R65_DFSDM: R65.2 U14.43(DFSDM)
R66_DFSDP: R66.2 U14.42(DFSDP)
R68_TST: R68.2 U14.51(TST)
R70_U16_BASE: R70.2 R75.2 U16.1(B)
RESET_EPS: C91.2 J7.10 R64.1 U14.47(NRSTB) ; also sheet 1,3
SW1_EN: U14.136(PC25) ; also sheet 3,5
SW2_EN: U14.135(PC24) ; also sheet 3,8
SW3_EN: U14.134(PC23) ; also sheet 3,8
SW4_EN: U14.133(PC22) ; also sheet 3,8
SW5_EN: U14.132(PC21) ; also sheet 3,8
U11_CS: U14.111(PA28) ; also sheet 3
U11_DIN: U14.20(PD7) ; also sheet 3
U11_DOUT: U14.21(PD8) ; also sheet 3
U11_SCLK: U14.88(PB17) ; also sheet 3
U17_U18: U17.7(2OUT) U18.1(G)
USB_DM: J8.A7(DN1) J8.B7(DN2) R65.1 U14.38(DHSDM)
USB_DP: J8.A6(DP1) J8.B6(DP2) R66.1 U14.37(DHSDP)
USB_OTG_ID: U14.129(PB11)
USB_OTG_VBOF: R70.1 U14.128(PB10)
USB_VBUS: C101.1 J8.A4(VBUS) J8.A9(VBUS) J8.B4(VBUS) J8.B9(VBUS) U14.39(VBUS) U18.3(D)
VBAT_EN: U14.112(PA29) ; also sheet 3,8
VBG: C92.1 R67.2 U14.40(VBG)
VDDANA: C80.1 C81.1 FB6.2 U14.73(VDDANA)
VDDOUT: C84.1 C85.1 C86.1 C87.1 C88.1 C89.1 C90.1 FB4.1 U14.10(VDDCORE1) U14.45(VDDCORE2) U14.56(VDDOUT) U14.61(VDDCORE3) U14.104(VDDCORE4) U14.124(VDDCORE5)
VDDOUTMI: C82.1 C83.1 FB7.2 U14.41(VDDOUTMI)
VDDPLL: C70.1 C71.1 FB4.2 U14.34(VDDPL)
XIN: C93.2 U14.36(XIN) Y1.3
XIN32: C96.2 U14.48(XIN32) Y2.2
XOUT: C94.1 U14.35(XOUT) Y1.1
XOUT32: C95.1 U14.49(XOUT32) Y2.1
Unconnected: J7.7 J8.A2(SSTXP1) J8.A3(SSTXN1) J8.A8(SBU1) J8.A10(SSRXN2) J8.A11(SSRXP2) J8.B2(SSTXP2) J8.B3(SSTXN2) J8.B8(SBU2) J8.B10(SSRXN1) J8.B11(SSRXP1) U14.1(PB26) U14.3(PA10) U14.4(PA11) U14.5(PA12) U14.6(PA13) U14.7(PA14) U14.8(PA15) U14.13(PD0) U14.14(PD1) U14.15(PD2) U14.16(PD3) U14.17(PD4) U14.18(PD5) U14.19(PD6) U14.22(PD9) U14.23(PA0) U14.24(PA1) U14.25(PA5) U14.26(PA7) U14.32(PD10) U14.50(SHDN) U14.55(PC1) U14.59(PC2) U14.60(PC3) U14.63(PC5) U14.64(PC6) U14.65(PC7) U14.66(PC8) U14.67(PC9) U14.68(PB27) U14.69(NRST) U14.71(PA19) U14.72(PA20) U14.76(PB15) U14.77(PB16) U14.78(PA16) U14.79(PA24) U14.80(PA23) U14.81(PA22) U14.82(PA6) U14.83(PA4) U14.84(PA3) U14.85(PA2) U14.86(PB12) U14.87(PB13) U14.89(PB18) U14.90(PB19) U14.91(PB20) U14.92(PB21) U14.93(PC11) U14.94(PC12) U14.95(PC13) U14.96(PC14) U14.97(PC15) U14.98(PC16) U14.99(PC17) U14.100(PC18) U14.101(PC19) U14.102(PC29) U14.103(PC30) U14.107(PA21) U14.108(PA25) U14.109(PA26) U14.110(PA27) U14.113(PB0) U14.114(PB1) U14.115(PB2) U14.116(PC4) U14.117(PC10) U14.118(PB3) U14.119(PB4) U14.120(PB5) U14.121(PB6) U14.122(PB7) U14.123(PB8) U14.127(PB9) U14.131(PC20) U14.137(PC26) U14.138(PC27) U14.140(PB14) U14.141(PB22) U14.142(PB23) U14.143(PB24) U17.1(1OUT) U17.2(1IN-) U17.3(1IN+)

## Library data of the parts
C1-C10 C64 C70-C98 C101 = DSD_Passive_Library:CAP: Capacitor Standard 0603 ceramic capacitor, and 0.1" leaded capacitor.
C33 = HSFL_Main_Library:CAP_2917
C34 C38-C63 C65-C69 = HSFL_Main_Library:CAP: Capacitor Standard 0603 ceramic capacitor, and 0.1" leaded capacitor.
D1-D7 = HSFL_Main_Library:MBR2H100SFT3G: MBR2H100 Series 100 V 2 A Surface Mount Schottky Power Rectifier - SOD-123F; AVAILABILITY: Unavailable; DESCRIPTION: Diode Schottky 100V 2A Surface Mount SOD-123FL; MF: ON Semiconductor; MP: MBR2H100SFT3G; PACKAGE: SOD-123 ON Semiconductor; PRICE: None
D8 = DSD_Passive_Library:DIODE
FB3 = HSFL_Main_Library:FB_0805
FB4-FB7 = DSD_Passive_Library:FB
H1 = HSFL_Main_Library:PC104_WCONN
J1-J6 = HSFL_Main_Library:2PIN_HEADER
J7 = DSD_Main_Library:CONN_2X5_127; BUILT_BY: EMA_Matt; COPYRIGHT: Copyright (C) 2018 Accelerated Designs. All rights reserved; MANUFACTURER_PART_NUMBER: 20021121-00010C4LF; SOURCELIBRARY: Amphenol_2019-10-30; VENDOR: Amphenol
J8 = DSD_Header_Library:USB-C: Type C, USB 3.1 Gen 2, Right Angle, Surface Mount (SMT) , USB Receptacle Buy Part <https://snapeda.com/parts/UJ31-CH-G1-SMT-TR/CUI%20Devices/view-part/?ref=eda>; AVAILABILITY: Warning; CUI_PURCHASE_URL: https://www.cuidevices.com/product/interconnect/connectors/usb-connectors/uj31-ch-g1-smt-tr?utm_source=snapeda.com&utm_medium=referral&utm_campaign=snapedaBOM; DESCRIPTION: Type C, USB 3.1 Gen 2, 5 A, Right Angle, Surface Mount (SMT) , USB Receptacle; DIGIKEY-PURCHASE-URL: https://snapeda.com/shop?store=DigiKey&id=2754415; MF: CUI Devices; MOUSER-PURCHASE-URL: https://snapeda.com/shop?store=Mouser&id=2754415; MP: UJ31-CH-G1-SMT-TR; PACKAGE: None; PRICE: None
L1 = DSD_Passive_Library:IND
L4-L6 = HSFL_Main_Library:XFL4020-222MEC: COILCRAFT - XFL4020-222MEC - INDUCTOR, 2.2UH, 8A, 20%, PWR, 38MHZ Source: Datasheet <https://www.coilcraft.com/pdfs/xfl4020.pdf>; ARROW_PART_NUMBER: XFL4020-222MEC; DESCRIPTION: COILCRAFT - XFL4020-222MEC - INDUCTOR, 2.2UH, 8A, 20%, PWR, 38MHZ; HEIGHT: 3mm; MANUFACTURER_NAME: COILCRAFT; MANUFACTURER_PART_NUMBER: XFL4020-222MEC; MOUSER_PART_NUMBER: 994-XFL4020-222MEC; MOUSER_PRICE-STOCK: https://www.mouser.co.uk/ProductDetail/Coilcraft/XFL4020-222MEC?qs=zCSbvcPd3pbe5jEAG1ZkEA%3D%3D
LED5 LED6 = DSD_Passive_Library:LED_0805
M1 = DSD_FETS_Library:SOT23_NMOS
NT1-NT3 = DSD_Passive_Library:GND-GNDA: Connect GND - GNDA without DRC-Error, display layer 53 (54) to make copper (ROUTE) from GND to GNDA Select also layer 53 (54) in CAM-Job!
R1-R10 R15-R18 R43 R44 R50 R62-R70 R73-R76 = DSD_Passive_Library:RESISTOR: Resistor Basic schematic elements and footprints for 0603, 1206, and PTH resistors.
R30-R34 R36-R42 R45-R48 R51-R61 = HSFL_Main_Library:RESISTOR: Resistor Basic schematic elements and footprints for 0603, 1206, and PTH resistors.
R99 = HSFL_Main_Library:CRCW20100000Z0EF: THICK FILM CHIP RESISTOR; ARROW_ELECTRONICS-PURCHASE-URL: https://snapeda.com/shop?store=Arrow+Electronics&id=217989; DESCRIPTION: 0 Ohms Jumper 0.75W, 3/4W Chip Resistor 2010 (5025 Metric) Automotive AEC-Q200 Thick Film; DIGI-KEY_PART_NUMBER: 541-0.0WCT-ND; MF: Vishay Dale; MOUSER-PURCHASE-URL: https://snapeda.com/shop?store=Mouser&id=217989; MP: CRCW20100000Z0EF; PACKAGE: 5025 Vishay
TB1 = HSFL_Main_Library:ARDUINO_NANO: Arduino Nano, Through Hole; AVAILABILITY: Unavailable; DESCRIPTION: ATmega4809 Arduino Nano Every with Headers AVR® AVR MCU 8-Bit Embedded Evaluation Board; MF: Arduino; MP: ARDUINO NANO; PACKAGE: None; PRICE: None
U1 = DSD_Active_Library:MP2639A; BUILT_BY: EMA_Kyle; COPYRIGHT: Copyright (C) 2018 Accelerated Designs. All rights reserved; DATASHEET: https://www.monolithicpower.com/en/documentview/productdocument/index/version/2/document_type/Datasheet/lang/en/sku/MP2639A/document_id/1451/; MANUFACTURER_PART_NUMBER: MP2639A; SOURCELIBRARY: Add_to_database_2020-10-15; VENDOR: Monolithic Power Systems Inc
U2 = HSFL_Main_Library:TCA9511A
U3-U5 = HSFL_Main_Library:LT8609A
U6-U10 = HSFL_Main_Library:LTC1477
U11 = HSFL_Main_Library:ADT7311: The ADT7311 is a high accuracy digital temperature sensor in a narrow 8-lead SOIC package. It contains a band gap temperature reference and a 16-bit ADC to monitor and digitize the temperature to a 0.0078°C resolution. The ADC resolution, by default, is set to 13 bits (0.0625°C). The ADC resolution is a user programmable mode that can be changed through the serial interface. br> The ADT7311 is guaranteed to operate over supply voltages from 2.7 V to 5.5 V. Operating at 3.3 V, the average supply current is typically 210 μA. The ADT7311 has a shutdown mode that powers down the device and offers a shutdown current of typically 2 μA. The ADT7311 is rated for operation over the −40°C to +150°C temperature range. br> The CT pin is an open-drain output that becomes active when the temperature exceeds a programmable critical temperature limit. The default critical temperature limit is 147°C. The INT pin is also an open-drain output that becomes active when the temperature exceeds a programmable limit. The INT and CT pins can operate in either comparator or interrupt mode.
U12 = HSFL_Main_Library:MAX16998AAUA+; BUILT_BY: EMA_UL_Team; MANUFACTURER_PART_NUMBER: MAX16998AAUA+; SOURCELIBRARY: Maxim_2014-05-21; VENDOR: Maxim Integrated Products
U13 = HSFL_Main_Library:TPS27082LDDCR; COMPTYPE: IC; MANUFACTURER: Texas Instruments; MOUNTTYPE: SMT; PACKAGEREFERENCE: DDC0006A; PARTNUMBER: TPS27082LDDC; PIN_COUNT: 6; REFDES: RefDes; ROHS: Y; TYPE: TYPE
U14 = DSD_Controller_Library:ATSAM3X8EA-AU
U15 U18 = DSD_FETS_Library:PMV48XP,215; BUILT_BY: EMA_Cory; COPYRIGHT: Copyright (C) 2018 Accelerated Designs. All rights reserved; MANUFACTURER_PART_NUMBER: PMV48XP,215; SOURCELIBRARY: Nexperia_2019-12-03; VENDOR: Nexperia
U16 = DSD_FETS_Library:BC847B-7-F
U17 = DSD_Active_Library:LMV358IDGKR; DATASHEET_URL: http://www.ti.com/lit/gpn/LMV358; DESCRIPTION: Dual Low-Voltage Rail-to-Rail Output Operational Amplifier; FAMILY_NAME: STANDARD LINEAR AMPLIFIER; GENERIC_PART_NUMBER: LMV358; INDUSTRY_STD_PKG_TYPE: MSOP; MANUFACTURER: Texas Instruments; MANUFACTURER_PART_NUMBER: LMV358IDGKR; PACKAGE_DESIGNATOR: DGK; PIN_COUNT: 8; VENDOR: Texas Instruments
U19 = DSD_Regulator_Library:NCP1117ST33T3G; COPYRIGHT: Copyright (C) 2016 Accelerated Designs. All rights reserved; MANUFACTURER_PART_NUMBER: NCP1117ST33T3G; SOURCELIBRARY: ONSemi_2017-12-12_4; VENDOR: ON Semiconductor
Y1 = DSD_Active_Library:ABM8
Y2 = DSD_Active_Library:FC-135R